# EAGLE design io_board (EAGLE 7.2.0)
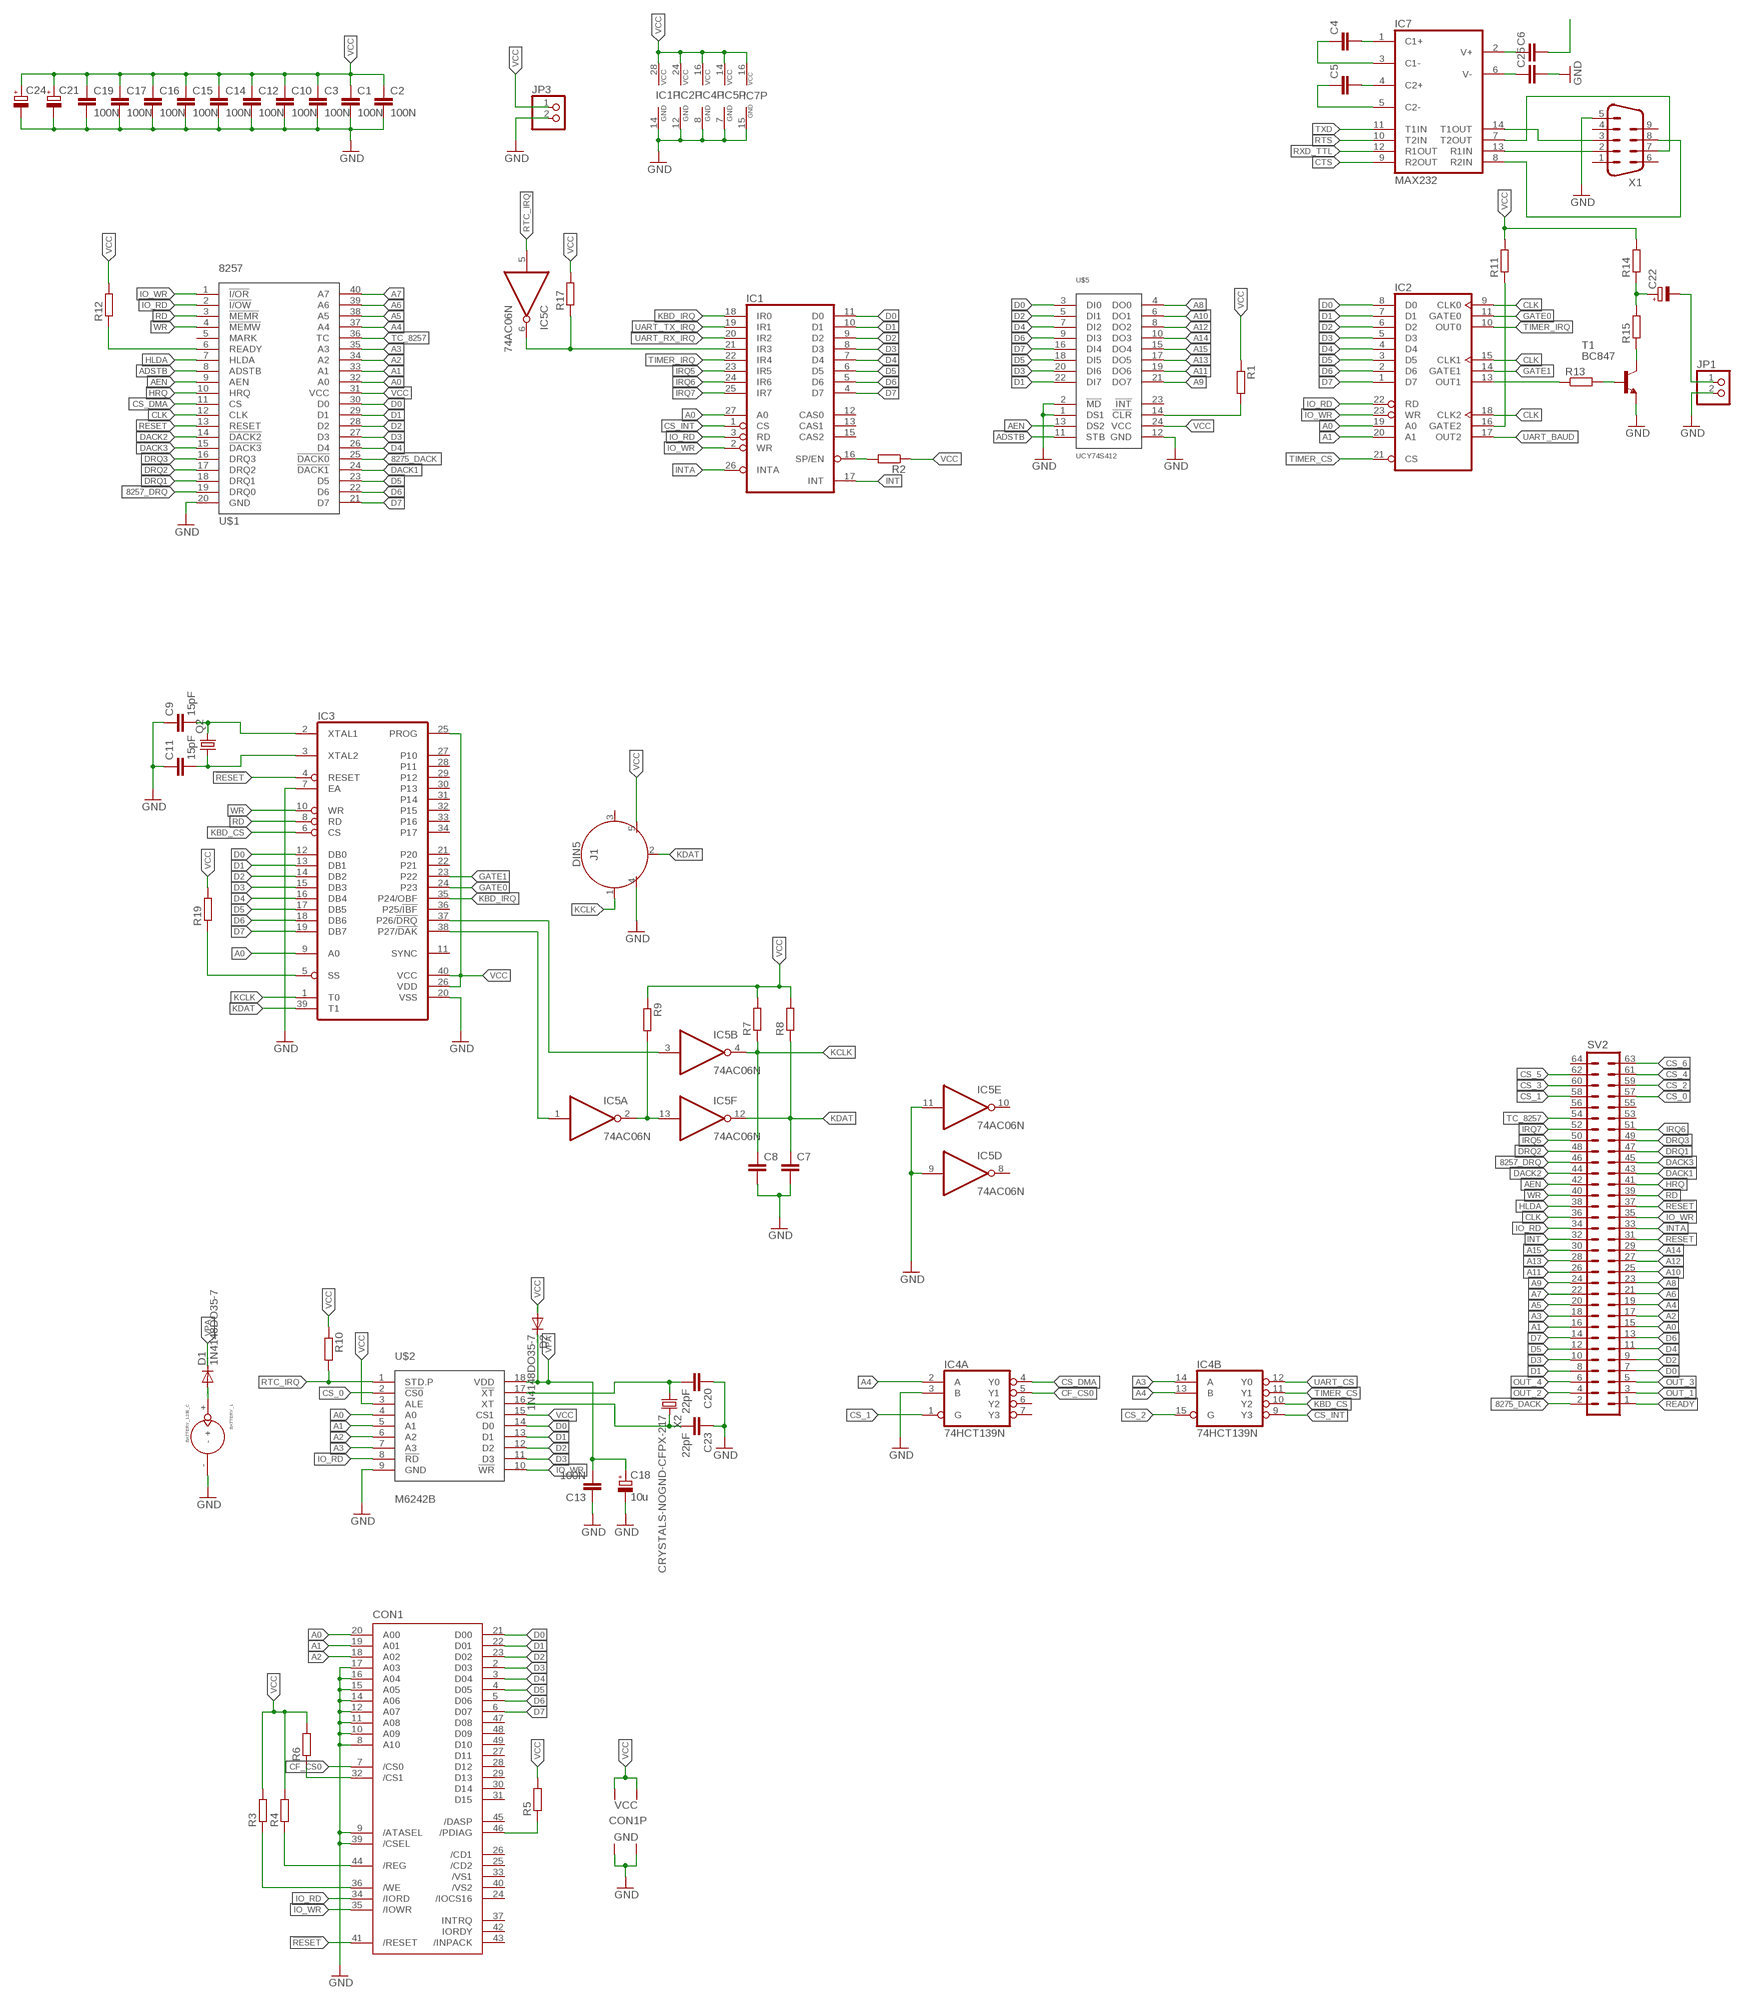
[diagram p0: schematic, sheet 1, part 1 of 2]
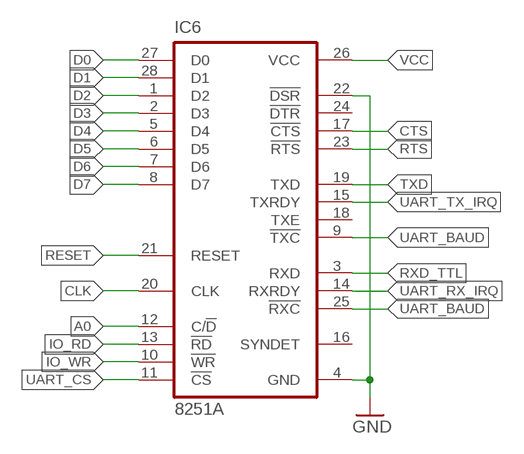
[diagram p1: schematic, sheet 1, part 2 of 2]

## Parts
BATTERY_1  BATTERY_1236_C  [BATTERY_1236_C]
C1  100N  C-EUC0603  [C0603]
C2  100N  C-EUC1206  [C1206]
C3  100N  C-EUC0603  [C0603]
C4  C-EUC0603  [C0603]
C5  C-EUC0603  [C0603]
C6  C-EUC0603  [C0603]
C7  C-EUC0603  [C0603]
C8  C-EUC0603  [C0603]
C9  15pF  C-EUC0603  [C0603]
C10  100N  C-EUC0603  [C0603]
C11  15pF  C-EUC0603  [C0603]
C12  100N  C-EUC0603  [C0603]
C13  100N  C-EUC0603  [C0603]
C14  100N  C-EUC0603  [C0603]
C15  100N  C-EUC0603  [C0603]
C16  100N  C-EUC0603  [C0603]
C17  100N  C-EUC0603  [C0603]
C18  10u  CPOL-EUSMCB  [SMC_B]
C19  100N  C-EUC0603  [C0603]
C20  22pF  C-EUC0603  [C0603]
C21  CPOL-EUE3.5-8  [E3,5-8]
C22  CPOL-EUE2-4  [E2-4]
C23  22pF  C-EUC0603  [C0603]
C24  CPOL-EUSMCB  [SMC_B]
C25  C-EUC0603  [C0603]
CON1  CF-CARD-IDE_MODE  [MI20-50PD-SF]
D1  1N4148DO35-7  [DO35-7]
D2  1N4148DO35-7  [DO35-7]
IC1  8259A  [DIL28-6]
IC2  8253  [DIL24-6]
IC3  UPI-8042AH  [DIL40]
IC4  74HCT139N  [DIL16]
IC5  74AC06N  [DIL14]
IC6  8251A  [DIL28-6]
IC7  MAX232  [DIL16]
J1  DIN5  [DIN5-RA-PTH]
JP1  PINHD-1X2  [1X02]
JP3  PINHD-1X2/90  [1X02/90]
Q2  CRYSTALHC49S  [HC49/S]
R1  R-EU_R0603  [R0603]
R2  R-EU_R0603  [R0603]
R3  R-EU_R0603  [R0603]
R4  R-EU_0204/7  [0204/7]
R5  R-EU_R0603  [R0603]
R6  R-EU_R0603  [R0603]
R7  R-EU_0204/5  [0204/5]
R8  R-EU_M0805  [M0805]
R9  R-EU_R0603  [R0603]
R10  R-EU_R0603  [R0603]
R11  R-EU_R0603  [R0603]
R12  R-EU_R0603  [R0603]
R13  R-EU_R0603  [R0603]
R14  R-EU_0204/5  [0204/5]
R15  R-EU_R0603  [R0603]
R17  R-EU_0204/7  [0204/7]
R19  R-EU_0204/5  [0204/5]
SV2  ML64L  [ML64L]
T1  BC847  [SOT23]
U$1  8257  [DIL40]
U$2  M6242B  [DIL18]
U$5  UCY74S412  [DIL24-6]
X1  M09HP  [M09HP]
X2  CRYSTALS-NOGND-CFPX-217  [3.2X1.5-2-PAD]

## Nets
8257_DRQ: SV2.46 U$1.19(DRQ0)
8275_DACK: SV2.2 U$1.25(!DACK0)
!RESET: CON1.41(/RESET) IC3.4(RESET) SV2.37
A0: CON1.20(A00) IC1.27(A0) IC2.19(A0) IC3.9(A0) IC6.12(C/!D) SV2.15 U$1.32(A0) U$2.4(A0)
A1: CON1.19(A01) IC2.20(A1) SV2.16 U$1.33(A1) U$2.5(A1)
A2: CON1.18(A02) SV2.17 U$1.34(A2) U$2.6(A2)
A3: IC4.14(B:A) SV2.18 U$1.35(A3) U$2.7(A3)
A4: IC4.2(A:A) IC4.13(B:B) SV2.19 U$1.37(A4)
A5: SV2.20 U$1.38(A5)
A6: SV2.21 U$1.39(A6)
A7: SV2.22 U$1.40(A7)
A8: SV2.23 U$5.4(DO0)
A9: SV2.24 U$5.21(DO7)
A10: SV2.25 U$5.6(DO1)
A11: SV2.26 U$5.19(DO6)
A12: SV2.27 U$5.8(DO2)
A13: SV2.28 U$5.17(DO5)
A14: SV2.29 U$5.10(DO3)
A15: SV2.30 U$5.15(DO4)
ADSTB: U$1.8(ADSTB) U$5.11(STB)
AEN: SV2.42 U$1.9(AEN) U$5.13(DS2)
CF_CS0: CON1.7(/CS0) IC4.5(A:Y1)
CLK: IC2.9(CLK0) IC2.15(CLK1) IC2.18(CLK2) IC6.20(CLK) SV2.36 U$1.12(CLK)
CS_0: SV2.57 U$2.2(!CS0)
CS_1: IC4.1(A:G) SV2.58
CS_2: IC4.15(B:G) SV2.59
CS_3: SV2.60
CS_4: SV2.61
CS_5: SV2.62
CS_6: SV2.63
CS_DMA: IC4.4(A:Y0) U$1.11(CS)
CS_INT: IC1.1(CS) IC4.9(B:Y3)
CTS: IC6.17(!CTS) IC7.9(R2OUT)
D0: CON1.21(D00) IC1.11(D0) IC2.8(D0) IC3.12(DB0) IC6.27(D0) SV2.7 U$1.30(D0) U$2.14(D0) U$5.3(DI0)
D1: CON1.22(D01) IC1.10(D1) IC2.7(D1) IC3.13(DB1) IC6.28(D1) SV2.8 U$1.29(D1) U$2.13(D1) U$5.22(DI7)
D2: CON1.23(D02) IC1.9(D2) IC2.6(D2) IC3.14(DB2) IC6.1(D2) SV2.9 U$1.28(D2) U$2.12(D2) U$5.5(DI1)
D3: CON1.2(D03) IC1.8(D3) IC2.5(D3) IC3.15(DB3) IC6.2(D3) SV2.10 U$1.27(D3) U$2.11(D3) U$5.20(DI6)
D4: CON1.3(D04) IC1.7(D4) IC2.4(D4) IC3.16(DB4) IC6.5(D4) SV2.11 U$1.26(D4) U$5.7(DI2)
D5: CON1.4(D05) IC1.6(D5) IC2.3(D5) IC3.17(DB5) IC6.6(D5) SV2.12 U$1.23(D5) U$5.18(DI5)
D6: CON1.5(D06) IC1.5(D6) IC2.2(D6) IC3.18(DB6) IC6.7(D6) SV2.13 U$1.22(D6) U$5.9(DI3)
D7: CON1.6(D07) IC1.4(D7) IC2.1(D7) IC3.19(DB7) IC6.8(D7) SV2.14 U$1.21(D7) U$5.16(DI4)
DACK1: SV2.43 U$1.24(!DACK1)
DACK2: SV2.44 U$1.14(!DACK2)
DACK3: SV2.45 U$1.15(!DACK3)
DRQ1: SV2.47 U$1.18(DRQ1)
DRQ2: SV2.48 U$1.17(DRQ2)
DRQ3: SV2.49 U$1.16(DRQ3)
GATE0: IC2.11(GATE0) IC3.24(P23)
GATE1: IC2.14(GATE1) IC3.23(P22)
GATE2: IC2.16(GATE2) R11.1
GND: BATTERY_1.- C1.2 C2.2 C3.2 C7.2 C8.2 C9.1 C10.2 C11.1 C12.2 C13.1 C14.2 C15.2 C16.2 C17.2 C18.- C19.2 C20.1 C21.- C23.1 C24.- C25.2 CON1.1(GND1) CON1.8(A10) CON1.9(/ATASEL) CON1.10(A09) CON1.11(A08) CON1.12(A07) CON1.14(A06) CON1.15(A05) CON1.16(A04) CON1.17(A03) CON1.39(/CSEL) CON1.50(GND2) IC1.14(GND) IC2.12(GND) IC3.7(EA) IC3.20(VSS) IC4.3(A:B) IC4.8(P:GND) IC5.7(P:GND) IC5.9(D:I) IC5.11(E:I) IC6.4(GND) IC6.22(!DSR) IC7.15(GND) J1.4 JP1.2 JP3.2 T1.2(E) U$1.20(GND) U$2.9(GND) U$5.1(DS1) U$5.2(!MD) U$5.12(GND) X1.5
HLDA: SV2.38 U$1.7(HLDA)
HRQ: SV2.41 U$1.10(HRQ)
INT: IC1.17(INT) SV2.32
INTA: IC1.26(INTA) SV2.33
IO_RD: CON1.34(/IORD) IC1.3(RD) IC2.22(RD) IC6.13(!RD) SV2.34 U$1.2(!I/OW) U$2.8(!RD)
IO_WR: CON1.35(/IOWR) IC1.2(WR) IC2.23(WR) IC6.10(!WR) SV2.35 U$1.1(!I/OR) U$2.10(!WR)
IRQ5: IC1.23(IR5) SV2.50
IRQ6: IC1.24(IR6) SV2.51
IRQ7: IC1.25(IR7) SV2.52
KBD_CS: IC3.6(CS) IC4.10(B:Y2)
KBD_IRQ: IC1.18(IR0) IC3.35(P24/OBF)
KCLK: C8.1 IC3.1(T0) IC5.4(B:O) J1.1 R7.1
KDAT: C7.1 IC3.39(T1) IC5.12(F:O) J1.2 R8.1
N$1: R1.2 U$5.14(!CLR)
N$2: IC1.16(SP/EN) R2.2
N$3: IC3.38(P27/!DAK) IC5.1(A:I)
N$4: CON1.36(/WE) R3.1
N$5: R12.1 U$1.6(READY)
N$6: IC2.13(OUT1) R13.1
N$7: IC7.7(T2OUT) X1.7
N$8: IC7.13(R1IN) X1.2
N$9: C4.2 IC7.1(C1+)
N$10: C5.2 IC7.4(C2+)
N$11: C5.1 IC7.5(C2-)
N$12: C4.1 IC7.3(C1-)
N$13: C6.1 IC7.2(V+)
N$14: C25.1 IC7.6(V-)
N$15: C9.2 IC3.2(XTAL1) Q2.2
N$16: C11.2 IC3.3(XTAL2) Q2.1
N$17: IC3.37(P26/!DRQ) IC5.3(B:I)
N$18: IC7.14(T1OUT) X1.3
N$19: CON1.44(/REG) R4.1
N$20: IC5.2(A:O) IC5.13(F:I) R9.2
N$21: CON1.46(/PDIAG) R5.1
N$22: BATTERY_1.+ D1.A
N$26: R13.2 T1.1(B)
N$27: R15.1 T1.3(C)
N$28: IC7.8(R2IN) X1.8
N$29: CON1.32(/CS1) R6.1
N$30: C22.- JP1.1
N$31: C22.+ R14.1 R15.2
N$32: IC1.21(IR3) IC5.6(C:O) R17.1
N$35: IC3.5(SS) R19.1
OUT_1: SV2.3
OUT_2: SV2.4
OUT_3: SV2.5
OUT_4: SV2.6
RD: IC3.8(RD) SV2.39 U$1.3(!MEMR)
READY: SV2.1
RESET: IC6.21(RESET) SV2.31 U$1.13(RESET)
RTC_IRQ: IC5.5(C:I) R10.2 U$2.1(STD.P)
RTS: IC6.23(!RTS) IC7.10(T2IN)
RXD_TTL: IC6.3(RXD) IC7.12(R1OUT)
SOSCI: C20.2 U$2.17(!XT) X2.1
SOSCO: C23.2 U$2.16(XT) X2.2
TC_8257: SV2.54 U$1.36(TC)
TIMER_CS: IC2.21(CS) IC4.11(B:Y1)
TIMER_IRQ: IC1.22(IR4) IC2.10(OUT0)
TXD: IC6.19(TXD) IC7.11(T1IN)
UART_BAUD: IC2.17(OUT2) IC6.9(!TXC) IC6.25(!RXC)
UART_CS: IC4.12(B:Y0) IC6.11(!CS)
UART_RX_IRQ: IC1.20(IR2) IC6.14(RXRDY)
UART_TX_IRQ: IC1.19(IR1) IC6.15(TXRDY)
VCC: C1.1 C2.1 C3.1 C6.2 C10.1 C12.1 C14.1 C15.1 C16.1 C17.1 C19.1 C21.+ C24.+ CON1.13(VCC2) CON1.38(VCC1) D2.A IC1.28(VCC) IC2.24(VCC) IC3.25(PROG) IC3.26(VDD) IC3.40(VCC) IC4.16(P:VCC) IC5.14(P:VCC) IC6.26(VCC) IC7.16(VCC) J1.5 JP3.1 R1.1 R2.1 R3.2 R4.2 R5.2 R6.2 R7.2 R8.2 R9.1 R10.1 R11.2 R12.2 R14.2 R17.2 R19.2 U$1.31(VCC) U$2.3(ALE) U$2.15(CS1) U$5.24(VCC)
VPA: C13.2 C18.+ D1.C D2.C U$2.18(VDD)
WR: IC3.10(WR) SV2.40 U$1.4(!MEMW)
Unconnected: CON1.24(/IOCS16) CON1.25(/CD2) CON1.26(/CD1) CON1.27(D11) CON1.28(D12) CON1.29(D13) CON1.30(D14) CON1.31(D15) CON1.33(/VS1) CON1.37(INTRQ) CON1.40(/VS2) CON1.42(IORDY) CON1.43(/INPACK) CON1.45(/DASP) CON1.47(D08) CON1.48(D09) CON1.49(D10) IC1.12(CAS0) IC1.13(CAS1) IC1.15(CAS2) IC3.11(SYNC) IC3.21(P20) IC3.22(P21) IC3.27(P10) IC3.28(P11) IC3.29(P12) IC3.30(P13) IC3.31(P14) IC3.32(P15) IC3.33(P16) IC3.34(P17) IC3.36(P25/!IBF) IC4.6(A:Y2) IC4.7(A:Y3) IC5.8(D:O) IC5.10(E:O) IC6.16(SYNDET) IC6.18(TXE) IC6.24(!DTR) J1.3 SV2.53 SV2.55 SV2.56 SV2.64 U$1.5(MARK) U$5.23(!INT) X1.1 X1.4 X1.6 X1.9

## Library data of the parts
BATTERY_1 = Itead_BP_110825.lbr:BATTERY_1236_C: SOC004
C1-C17 C19 C20 C23 C25 = rcl:C-EU: CAPACITOR, European symbol
C18 C21 C22 C24 = rcl:CPOL-EU: POLARIZED CAPACITOR, European symbol
CON1 = con-hirose:CF-CARD-IDE_MODE: Compact Flash Adapter Type I or II without Eject Button Source: con-hirose.lbr from Bob Starr <rtzaudio@mindspring.com>; OC_FARNELL: unknown; OC_NEWARK: unknown
D1 D2 = diode:1N4148: DIODE high speed (Philips)
IC1 = micro-intel:8259A: MICROCOMPUTER/PERIPHERAL DEVICE; OC_FARNELL: unknown; OC_NEWARK: unknown
IC2 = micro-intel:8253: MICROCOMPUTER/PERIPHERAL DEVICE; OC_FARNELL: unknown; OC_NEWARK: unknown
IC3 = micro-intel:UPI-8042AH: MICROCOMPUTER/PERIPHERAL DEVICE; OC_FARNELL: unknown; OC_NEWARK: unknown
IC4 = 74xx-eu:74*139: Dual 2-line to 4-line DECODER/DEMULTIPLEXER
IC5 = 74xx-eu:74*06: Hex INVERTER, open collector high-voltage output
IC6 = micro-intel:8251A: Universal Syncronous/Asynchronous Receiver/Transmitter (USART) Source: http://www.alldatasheet.com/datasheet-pdf/pdf/INTEL/8251A.html; OC_FARNELL: unknown; OC_NEWARK: unknown
IC7 = maxim:MAX232: RS232 TRANSCEIVER; MF: MAXIM; MPN: MAX232ACPE+; OC_FARNELL: 9723773; OC_NEWARK: 68K4544
J1 = SparkFun-Connectors:DIN5: DIN5 Connector - Female Right Angle (frequently used as a MIDI Jack connector) This type of connector and cable is frequently used for transmitting midi data (musical instrument digital interface). It is what you usually see on a keyboard or set of electronic drums. Learn more here <https://en.wikipedia.org/wiki/MIDI>. For more information on the pinout and electrical specifications of MIDI communications, please see the following resource: https://www.midi.org/specifications/item/midi-din-electrical-specification Here is the connector we sell at SparkFun: MIDI Connector - Female Right Angle <https://www.sparkfun.com/products/9536> (PRT-09536) Datasheet <hhttp://www.sparkfun.com/datasheets/Prototyping/Connectors/MIDI-RA.pdf> It is used on this SparkFun product: SparkFun MIDI Shield <https://www.sparkfun.com/products/12898> (DEV-12898); PROD_ID: CONN-09481
JP1 JP3 = pinhead:PINHD-1X2: PIN HEADER
Q2 = crystal:CRYSTAL: CRYSTAL; OC_FARNELL: 1667008; OC_NEWARK: unknown
R1-R15 R17 R19 = rcl:R-EU_: RESISTOR, European symbol
SV2 = con-harting-ml:ML64: HARTING; OC_FARNELL: unknown; OC_NEWARK: unknown
T1 = transistor:BC847: NPN TRANSISTOR
U$1 = mw:8257
U$2 = mw:M6242B
U$5 = mw:UCY74S412
X1 = con-subd:M09: SUB-D; OC_FARNELL: unknown; OC_NEWARK: unknown
X2 = IQD-Frequency-Products:CRYSTALS-NOGND: CRYSTALS CAN NOT GROUNDED

## Board
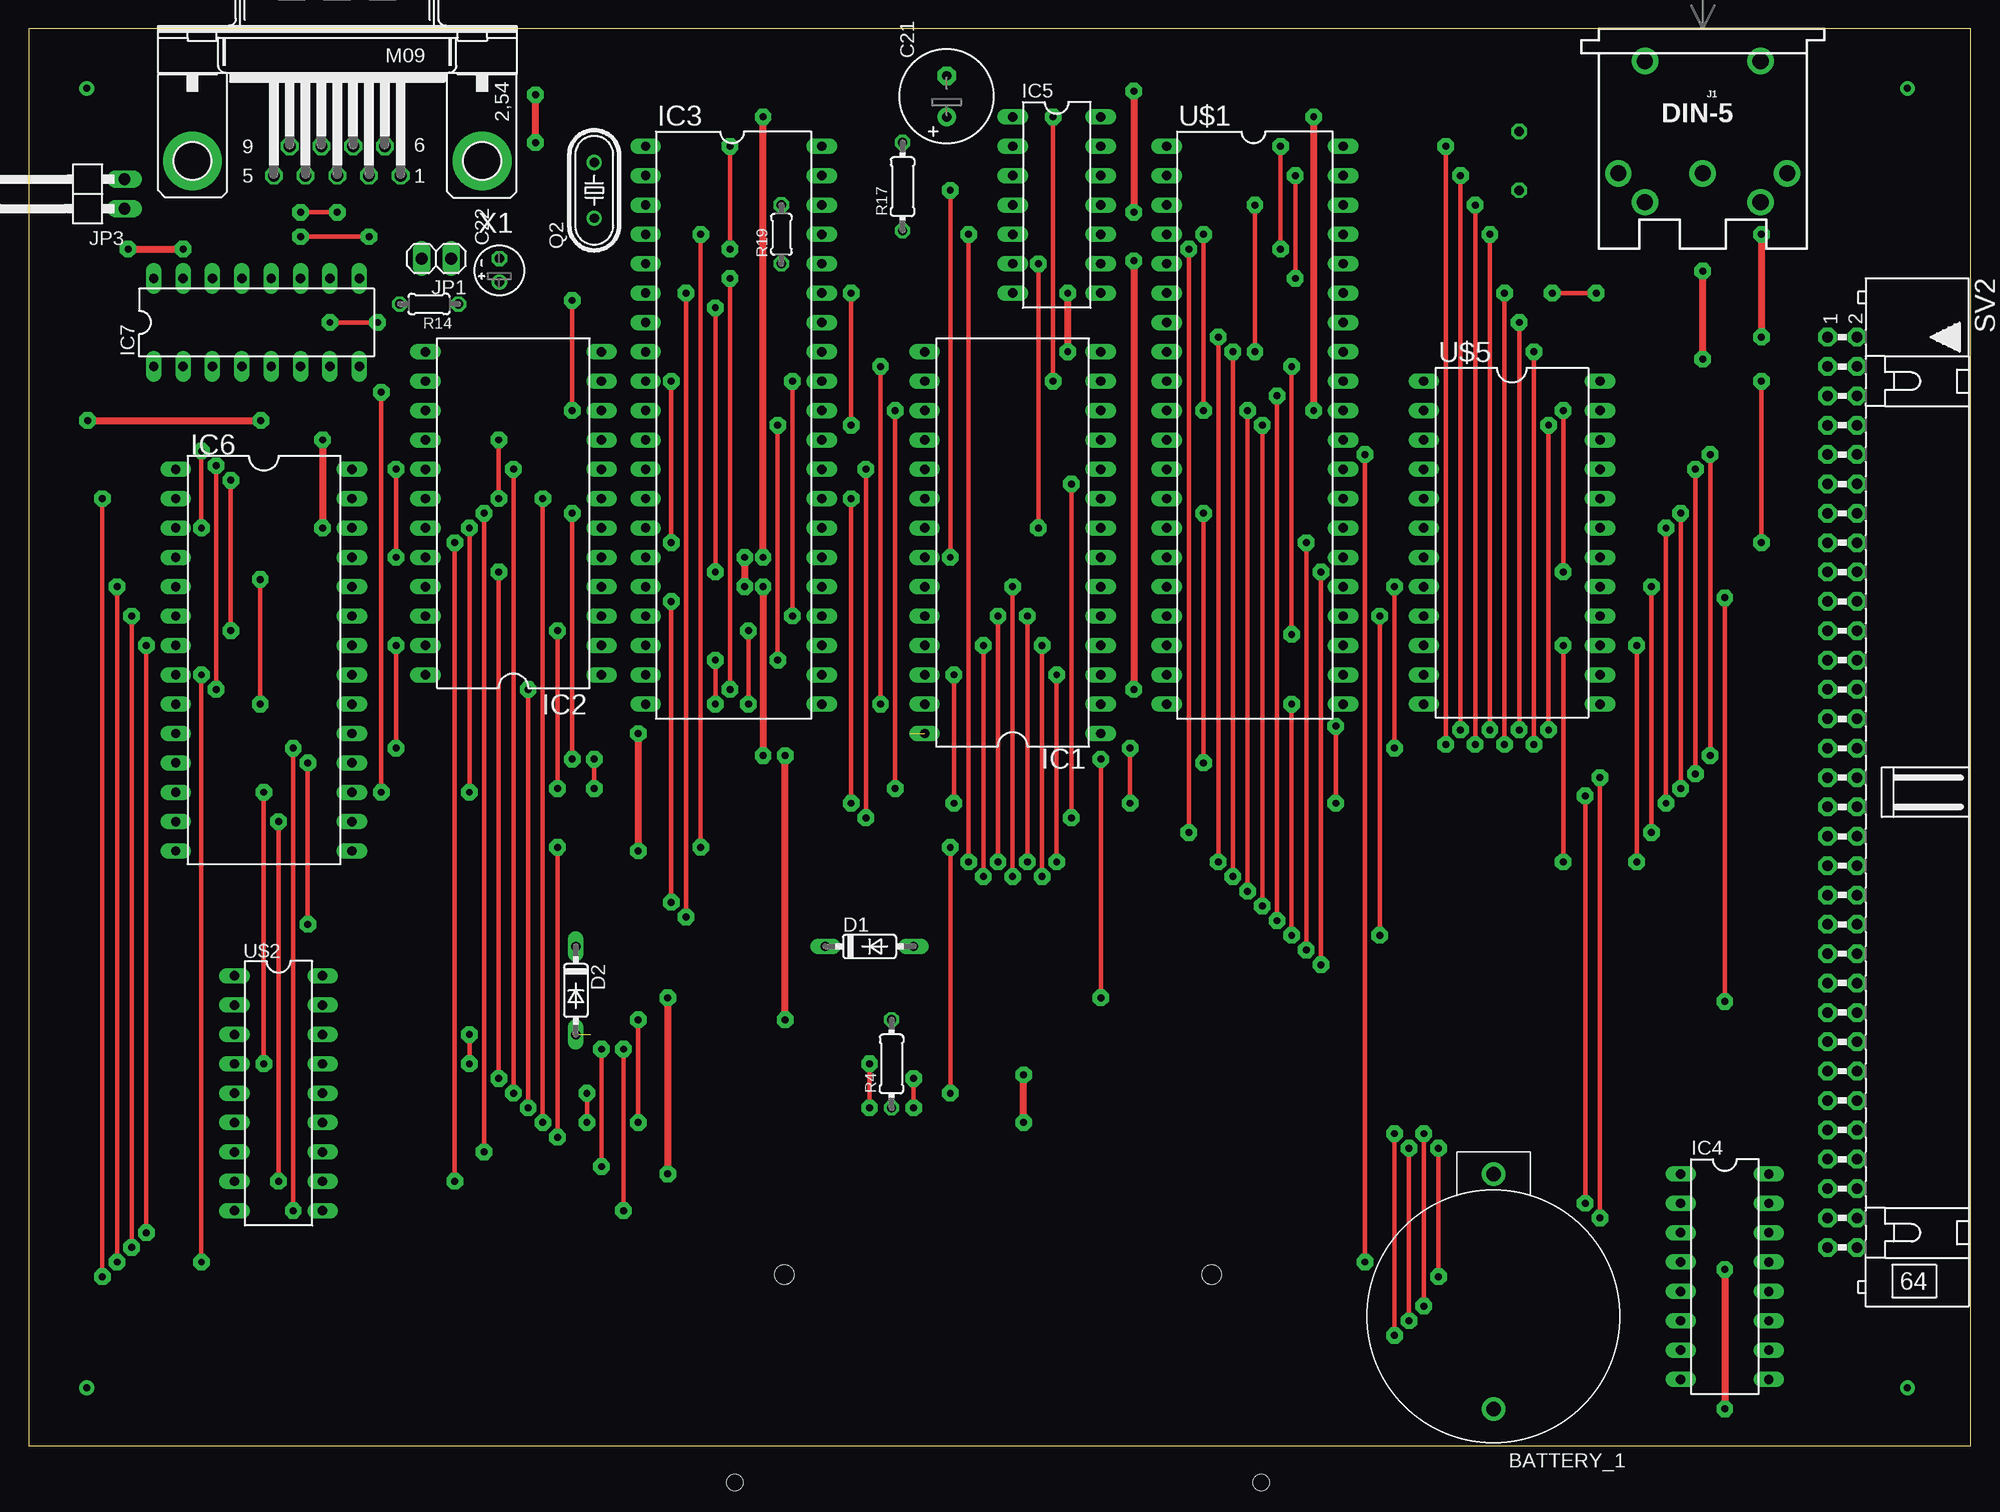
[diagram p2: board, top side]
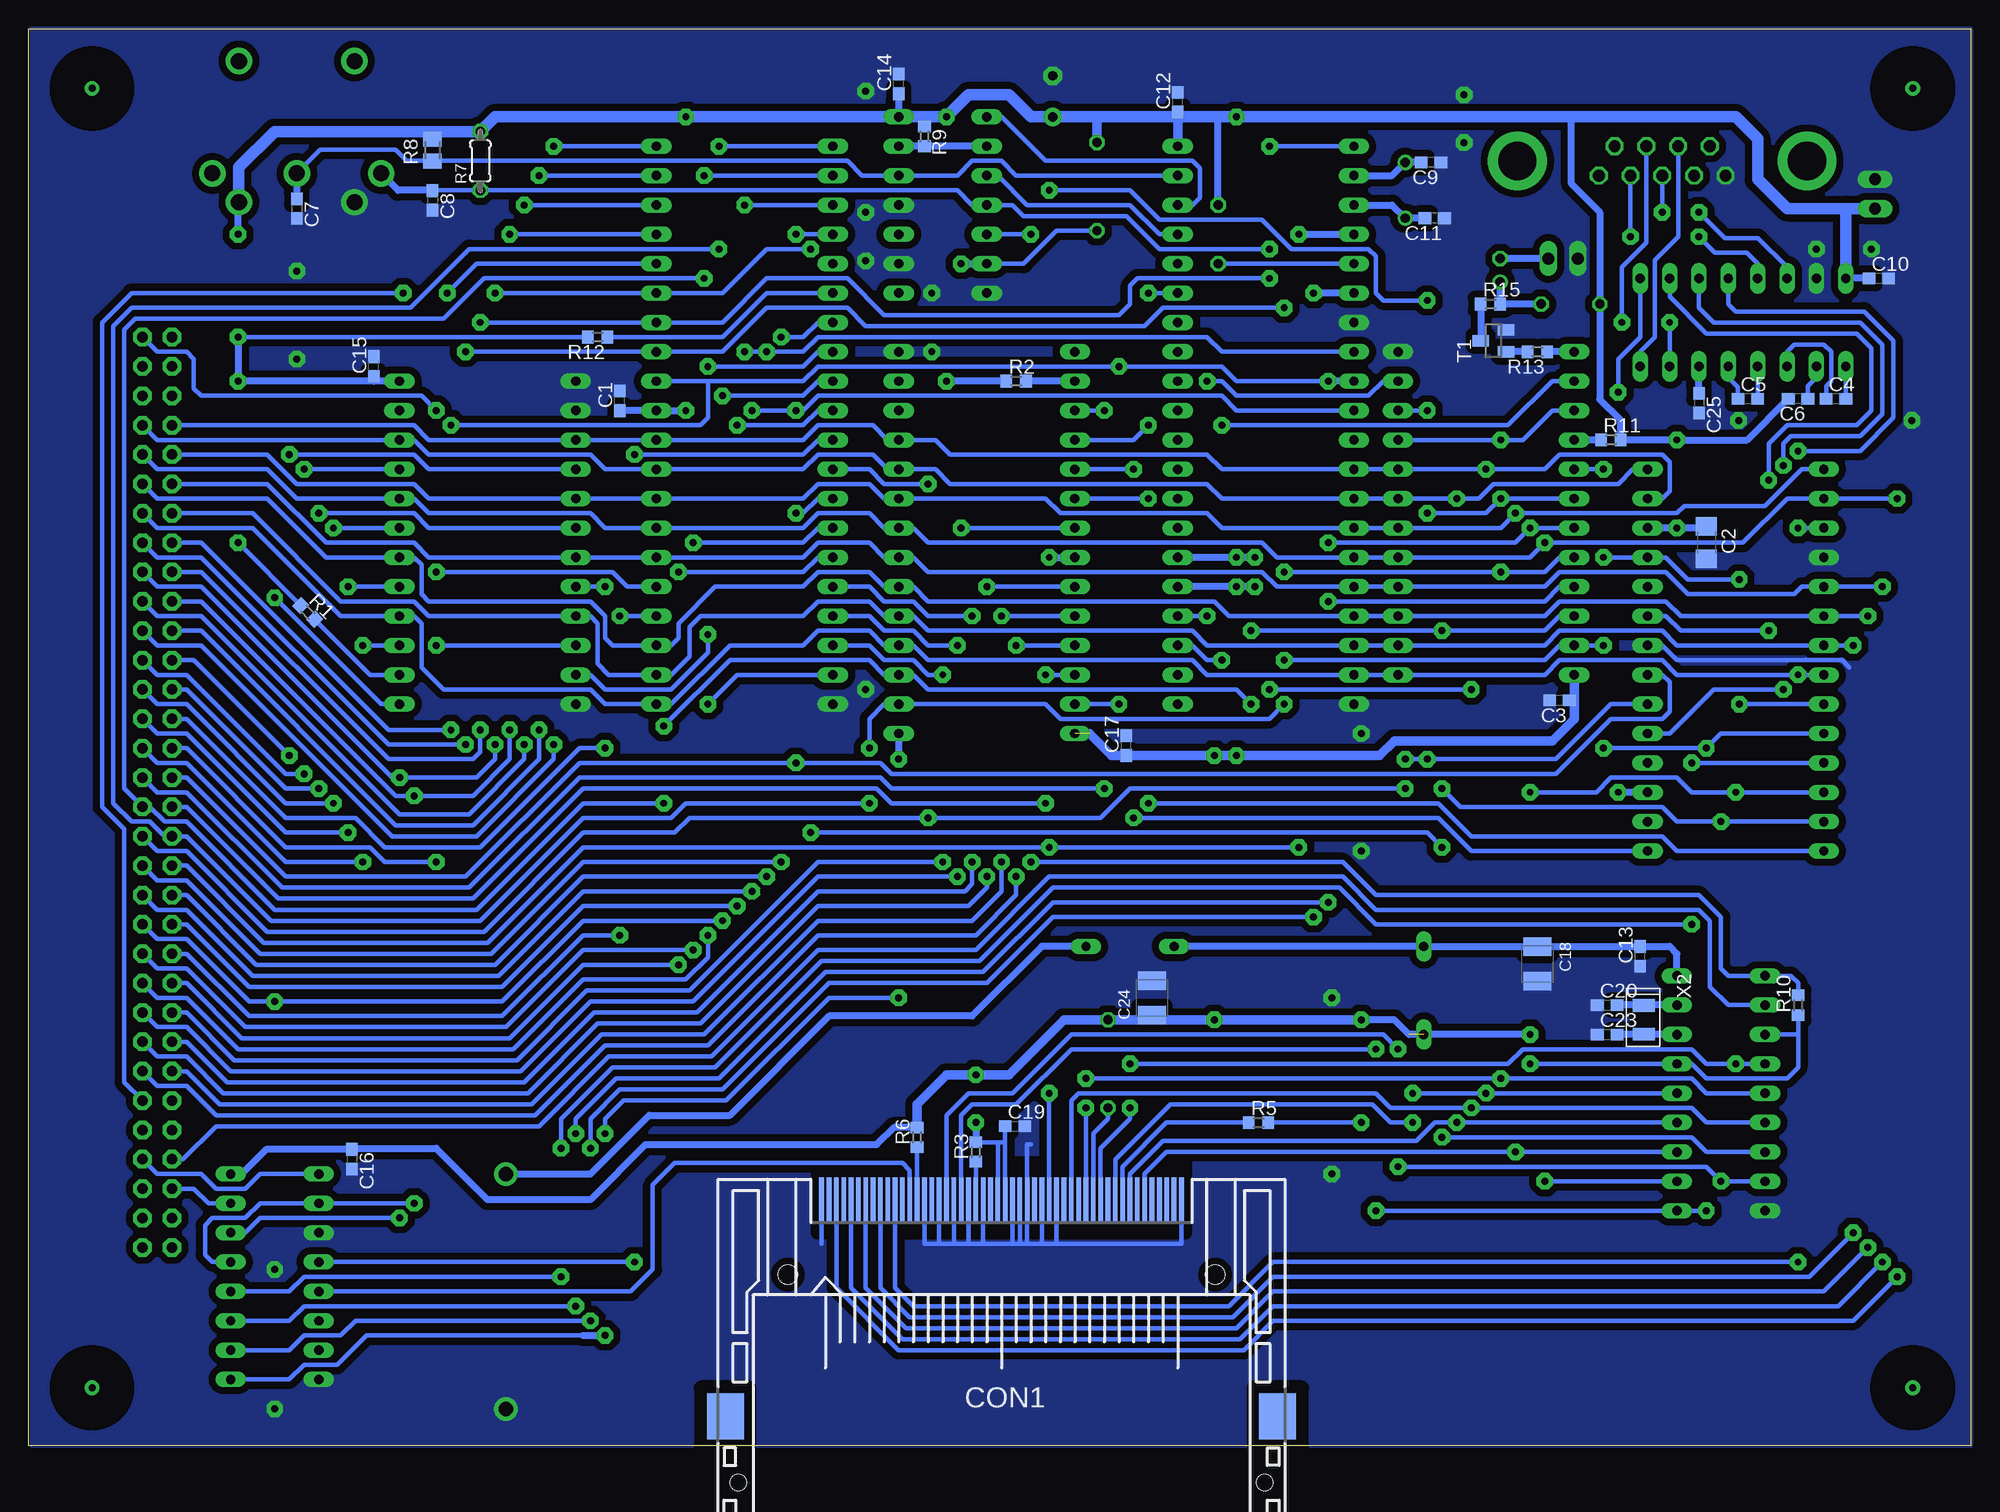
[diagram p3: board, bottom side, seen from below]

Size 167.94 x 122.55 mm. Coordinates in mm from the lower left corner, seen from the top.
Outline: 0,0 167.94,0 167.94,122.55 0,122.55 0,0
Copper layers (1*16): Top 0.035mm / dielectric 1.5mm / Bottom 0.035mm
Design rules "default *": minimum track width 10mil, minimum drill 24mil, track to track 8mil, track to pad 8mil, pad to pad 8mil, via to via 8mil, smd to smd 8mil, copper to edge 0mil, drill to drill 8mil, minimum pad ring 10mil, minimum via ring 8mil, stop-mask expansion 4mil, vias tented up to drill 0mil, thermal gap 10mil
bRestrict: area 2,2 to 8,8; area 2,114.3 to 8,120.4; area 159.4,2 to 165.5,8; area 159.4,114.3 to 165.5,120.4; area 67.9,18.4 to 99.7,24.4

### Footprints (pad centres in the part's own frame; a part is rotated, then mirrored left to right if it is on the bottom)
BATTERY_1236_C = drill 1.27 pad 2.032: + 0,0; - 0,20.32
C0603 = smd 1.1 x 1: 1 -0.85,0; 2 0.85,0
C1206 = smd 1.6 x 1.8: 1 -1.4,0; 2 1.4,0
SMC_B = smd 1.6 x 2.4: + -1.5,0; - 1.5,0
E3,5-8 = drill 0.813 pad 1.6: + -1.778,0 | drill 0.813 pad 1.6 octagon: - 1.778,0
E2-4 = drill 0.813 pad 1.27: + -1.016,0 | drill 0.813 pad 1.27 octagon: - 1.016,0
MI20-50PD-SF = smd 0.41 x 3.75: 1 15.557,-18.78; 2 14.287,-18.78; 3 13.018,-18.78; 4 11.748,-18.78; 5 10.477,-18.78; 6 9.207,-18.78; 7 7.938,-18.78; 8 6.668,-18.78; 9 5.397,-18.78; 10 4.128,-18.78; 11 2.857,-18.78; 12 1.587,-18.78; 13 0.318,-18.78; 14 -0.953,-18.78; 15 -2.223,-18.78; 16 -3.493,-18.78; 17 -4.763,-18.78; 18 -6.032,-18.78; 19 -7.303,-18.78; 20 -8.572,-18.78; 21 -9.842,-18.78; 22 -11.113,-18.78; 23 -12.383,-18.78; 24 -13.652,-18.78; 25 -14.922,-18.78; 26 14.922,-18.78; 27 13.652,-18.78; 28 12.383,-18.78; 29 11.113,-18.78; 30 9.842,-18.78; 31 8.572,-18.78; 32 7.303,-18.78; 33 6.032,-18.78; 34 4.763,-18.78; 35 3.493,-18.78; 36 2.223,-18.78; 37 0.953,-18.78; 38 -0.318,-18.78; 39 -1.587,-18.78; 40 -2.857,-18.78; 41 -4.128,-18.78; 42 -5.397,-18.78; 43 -6.668,-18.78; 44 -7.938,-18.78; 45 -9.207,-18.78; 46 -10.477,-18.78; 47 -11.748,-18.78; 48 -13.018,-18.78; 49 -14.287,-18.78; 50 -15.557,-18.78 | smd 3.2 x 4: M1 -23.883,-0.005; M2 23.883,-0.005 | hole 1.676: 18.5,-12.25; -18.5,-12.25 | hole 1.422: -22.75,5.75; 22.75,5.75
DO35-7 = drill 0.813 long: A 3.81,0; C -3.81,0
DIL28-6 = drill 0.813 long: 1 -16.51,-7.62; 2 -13.97,-7.62; 3 -11.43,-7.62; 4 -8.89,-7.62; 5 -6.35,-7.62; 6 -3.81,-7.62; 7 -1.27,-7.62; 8 1.27,-7.62; 9 3.81,-7.62; 10 6.35,-7.62; 11 8.89,-7.62; 12 11.43,-7.62; 13 13.97,-7.62; 14 16.51,-7.62; 15 16.51,7.62; 16 13.97,7.62; 17 11.43,7.62; 18 8.89,7.62; 19 6.35,7.62; 20 3.81,7.62; 21 1.27,7.62; 22 -1.27,7.62; 23 -3.81,7.62; 24 -6.35,7.62; 25 -8.89,7.62; 26 -11.43,7.62; 27 -13.97,7.62; 28 -16.51,7.62
DIL24-6 = drill 0.813 long: 1 -13.97,-7.62; 2 -11.43,-7.62; 3 -8.89,-7.62; 4 -6.35,-7.62; 5 -3.81,-7.62; 6 -1.27,-7.62; 7 1.27,-7.62; 8 3.81,-7.62; 9 6.35,-7.62; 10 8.89,-7.62; 11 11.43,-7.62; 12 13.97,-7.62; 13 13.97,7.62; 14 11.43,7.62; 15 8.89,7.62; 16 6.35,7.62; 17 3.81,7.62; 18 1.27,7.62; 19 -1.27,7.62; 20 -3.81,7.62; 21 -6.35,7.62; 22 -8.89,7.62; 23 -11.43,7.62; 24 -13.97,7.62
DIL40 = drill 0.813 long: 1 -24.13,-7.62; 2 -21.59,-7.62; 3 -19.05,-7.62; 4 -16.51,-7.62; 5 -13.97,-7.62; 6 -11.43,-7.62; 7 -8.89,-7.62; 8 -6.35,-7.62; 9 -3.81,-7.62; 10 -1.27,-7.62; 11 1.27,-7.62; 12 3.81,-7.62; 13 6.35,-7.62; 14 8.89,-7.62; 15 11.43,-7.62; 16 13.97,-7.62; 17 16.51,-7.62; 18 19.05,-7.62; 19 21.59,-7.62; 20 24.13,-7.62; 21 24.13,7.62; 22 21.59,7.62; 23 19.05,7.62; 24 16.51,7.62; 25 13.97,7.62; 26 11.43,7.62; 27 8.89,7.62; 28 6.35,7.62; 29 3.81,7.62; 30 1.27,7.62; 31 -1.27,7.62; 32 -3.81,7.62; 33 -6.35,7.62; 34 -8.89,7.62; 35 -11.43,7.62; 36 -13.97,7.62; 37 -16.51,7.62; 38 -19.05,7.62; 39 -21.59,7.62; 40 -24.13,7.62
DIL16 = drill 0.813 long: 1 -8.89,-3.81; 2 -6.35,-3.81; 3 -3.81,-3.81; 4 -1.27,-3.81; 5 1.27,-3.81; 6 3.81,-3.81; 7 6.35,-3.81; 8 8.89,-3.81; 9 8.89,3.81; 10 6.35,3.81; 11 3.81,3.81; 12 1.27,3.81; 13 -1.27,3.81; 14 -3.81,3.81; 15 -6.35,3.81; 16 -8.89,3.81
DIL14 = drill 0.813 long: 1 -7.62,-3.81; 2 -5.08,-3.81; 3 -2.54,-3.81; 4 0,-3.81; 5 2.54,-3.81; 6 5.08,-3.81; 7 7.62,-3.81; 8 7.62,3.81; 9 5.08,3.81; 10 2.54,3.81; 11 0,3.81; 12 -2.54,3.81; 13 -5.08,3.81; 14 -7.62,3.81
DIN5-RA-PTH = drill 1.4 pad 2.286: 1 7.3,12.5; 2 0,12.5; 3 -7.3,12.5; 4 5,15; 5 -5,15; 6 -5,2.8; 7 5,2.8
1X02 = drill 1.016 long: 1 -1.27,0; 2 1.27,0
1X02/90 = drill 1.016 long: 1 -1.27,-3.81; 2 1.27,-3.81
HC49/S = drill 0.813: 1 -2.413,0; 2 2.413,0
R0603 = smd 1 x 1.1: 1 -0.85,0; 2 0.85,0
0204/7 = drill 0.813 octagon: 1 -3.81,0; 2 3.81,0
0204/5 = drill 0.813 octagon: 1 -2.54,0; 2 2.54,0
M0805 = smd 1.3 x 1.6: 1 -0.95,0; 2 0.95,0
ML64L = drill 0.914 pad 1.6 octagon: 1 -39.37,-1.27; 2 -39.37,1.27; 3 -36.83,-1.27; 4 -36.83,1.27; 5 -34.29,-1.27; 6 -34.29,1.27; 7 -31.75,-1.27; 8 -31.75,1.27; 9 -29.21,-1.27; 10 -29.21,1.27; 11 -26.67,-1.27; 12 -26.67,1.27; 13 -24.13,-1.27; 14 -24.13,1.27; 15 -21.59,-1.27; 16 -21.59,1.27; 17 -19.05,-1.27; 18 -19.05,1.27; 19 -16.51,-1.27; 20 -16.51,1.27; 21 -13.97,-1.27; 22 -13.97,1.27; 23 -11.43,-1.27; 24 -11.43,1.27; 25 -8.89,-1.27; 26 -8.89,1.27; 27 -6.35,-1.27; 28 -6.35,1.27; 29 -3.81,-1.27; 30 -3.81,1.27; 31 -1.27,-1.27; 32 -1.27,1.27; 33 1.27,-1.27; 34 1.27,1.27; 35 3.81,-1.27; 36 3.81,1.27; 37 6.35,-1.27; 38 6.35,1.27; 39 8.89,-1.27; 40 8.89,1.27; 41 11.43,-1.27; 42 11.43,1.27; 43 13.97,-1.27; 44 13.97,1.27; 45 16.51,-1.27; 46 16.51,1.27; 47 19.05,-1.27; 48 19.05,1.27; 49 21.59,-1.27; 50 21.59,1.27; 51 24.13,-1.27; 52 24.13,1.27; 53 26.67,-1.27; 54 26.67,1.27; 55 29.21,-1.27; 56 29.21,1.27; 57 31.75,-1.27; 58 31.75,1.27; 59 34.29,-1.27; 60 34.29,1.27; 61 36.83,-1.27; 62 36.83,1.27; 63 39.37,-1.27; 64 39.37,1.27
SOT23 = smd 1 x 1.4: 1 -0.95,-1.1; 2 0.95,-1.1; 3 0,1.1
DIL18 = drill 0.813 long: 1 -10.16,-3.81; 2 -7.62,-3.81; 3 -5.08,-3.81; 4 -2.54,-3.81; 5 0,-3.81; 6 2.54,-3.81; 7 5.08,-3.81; 8 7.62,-3.81; 9 10.16,-3.81; 10 10.16,3.81; 11 7.62,3.81; 12 5.08,3.81; 13 2.54,3.81; 14 0,3.81; 15 -2.54,3.81; 16 -5.08,3.81; 17 -7.62,3.81; 18 -10.16,3.81
M09HP = drill 1.016 octagon: 1 -5.486,1.27; 2 -2.743,1.27; 3 0,1.27; 4 2.743,1.27; 5 5.486,1.27; 6 -4.115,-1.27; 7 -1.372,-1.27; 8 1.372,-1.27; 9 4.115,-1.27 | drill 3.302 pad 5.08: G1 -12.522,0; G2 12.522,0
3.2X1.5-2-PAD = smd 1.1 x 1.9: 1 -1.25,0; 2 1.25,0

### Placement (x,y rotation side)
BATTERY_1  126.68,23.5 180 top
C1  116.84,90.39 90 bottom
C2  22.86,78.11 270 bottom
C3  35.56,64.45 180 bottom
C4  11.65,90.55 0 bottom
C5  19.27,90.55 0 bottom
C6  14.92,90.55 180 bottom
C7  144.78,107 270 bottom
C8  133.03,107.71 270 bottom
C9  46.67,111 180 bottom
C10  7.94,100.97 0 bottom
C11  46.35,106.17 180 bottom
C12  68.58,116.2 90 bottom
C13  28.57,42.33 90 bottom
C14  92.71,117.79 90 bottom
C15  138.11,93.34 90 bottom
C16  140.02,24.77 270 bottom
C17  73.03,60.54 90 bottom
C18  37.47,41.67 270 bottom
C19  82.65,27.62 0 bottom
C20  31.43,38.1 0 bottom
C21  79.38,116.71 90 top
C22  40.69,101.66 90 top
C23  31.43,35.56 0 bottom
C24  70.8,38.73 90 bottom
C25  23.5,90.17 270 bottom
CON1  83.82,2.54 180 bottom
D1  72.71,43.18 0 top
D2  47.31,39.37 270 top
IC1  85.09,78.11 90 top
IC2  41.91,80.64 90 top
IC3  60.96,88.27 270 top
IC4  146.69,14.61 270 top
IC5  88.9,107.31 270 top
IC6  20.32,67.94 270 top
IC7  19.68,97.16 0 top
J1  144.78,122.56 180 top
JP1  35.24,102.68 180 top
JP3  4.45,108.27 90 top
Q2  48.9,108.58 90 top
R1  143.83,72.07 315 bottom
R2  82.55,92.08 0 bottom
R3  86.04,25.4 90 bottom
R4  74.61,33.02 90 top
R5  61.59,27.94 0 bottom
R6  91.12,26.67 90 bottom
R7  128.91,111.12 90 bottom
R8  133.03,112.07 90 bottom
R9  90.49,113.25 270 bottom
R10  14.92,38.1 90 bottom
R11  31.11,87 0 bottom
R12  118.75,95.89 180 bottom
R13  37.47,94.61 180 bottom
R14  34.61,98.74 180 top
R15  41.54,98.74 0 bottom
R17  75.56,108.9 90 top
R19  65.09,104.78 90 top
SV2  156.84,56.52 270 top
T1  41.27,95.57 90 bottom
U$1  106.05,88.27 270 top
U$2  21.59,30.48 270 top
U$5  128.27,78.11 270 top
X1  26.67,111.12 180 top
X2  28.26,36.83 270 bottom

### Tracks (layer width: path | path; a pad name or v marks a point on that pad's centre or on a via)
8257_DRQ  (via drill 0.6 pad 1.42)
  Top 0.406: v109.22,64.14 v109.22,44.13
  Bottom 0.406: U$1.19 106.68,66.67 v109.22,64.14 | SV2.46 156.84,38.73 154.31,38.73 149.86,34.29 126.05,34.29 120.02,40.32 111.12,40.32 109.22,42.23 v109.22,44.13
8275_DACK  (via drill 0.6 pad 1.42)
  Top 0.406: v132.72,75.56 v132.72,89.53
  Bottom 0.406: U$1.25 116.2,74.3 117.47,75.56 v132.72,75.56 | SV2.2 156.84,94.61 154.31,94.61 153.67,93.98 153.67,91.44 153.03,90.81 133.99,90.81 v132.72,89.53
!RESET  (via drill 0.6 pad 1.42)
  Top 0.406: v58.1,51.75 v58.1,104.78 | v79.69,30.48 v79.69,51.75
  Bottom 0.406: SV2.37 154.31,50.16 147.64,43.5 128.27,43.5 120.02,51.75 v58.1,51.75 v79.69,51.75 | CON1.41 v79.69,30.48
  Bottom 0.61: v58.1,104.78 IC3.4
A0  (via drill 0.6 pad 1.42)
  Top 0.406: v131.44,61.91 v131.44,88.27 | v73.66,64.14 v73.66,93.34 | v55.56,78.11 v55.56,92.08 | v38.1,56.52 v38.1,79.38 | v20.32,33.02 v20.32,56.52 | v72.71,33.02 v72.71,29.21
  Bottom 0.406: SV2.15 153.03,78.11 136.84,61.91 v131.44,61.91 | v131.44,88.27 109.86,88.27 109.22,88.9 109.22,92.08 | 109.22,92.08 100.97,92.08 99.69,93.34 v73.66,93.34 64.77,93.34 63.5,92.08 v55.56,92.08 | 109.22,92.08 U$1.32 | IC1.27 v73.66,64.14 | U$2.4 v20.32,33.02 22.86,33.02 24.13,34.29 38.73,34.29 40.01,33.02 v72.71,33.02 | IC6.12 v20.32,56.52 24.13,56.52 25.4,57.78 31.11,57.78 32.38,56.52 v38.1,56.52 | IC2.19 v38.1,79.38 39.37,78.11 v55.56,78.11 | CON1.20 75.25,25.72 72.71,28.26 v72.71,29.21
  Bottom 0.61: IC3.9 v55.56,92.08
A1  (via drill 0.6 pad 1.42)
  Top 0.406: v130.18,60.64 v130.18,94.61 | v59.37,75.56 v59.37,98.42 | v40.64,31.75 v40.64,75.56 | v76.52,29.21 v76.52,31.75
  Bottom 0.406: SV2.16 156.84,76.83 153.03,76.83 136.84,60.64 v130.18,60.64 | v130.18,94.61 U$1.33 107.95,94.61 104.14,98.42 97.16,98.42 95.57,96.84 71.44,96.84 69.85,98.42 v59.37,98.42 | IC2.20 35.56,76.83 36.83,75.56 v40.64,75.56 v59.37,75.56 | U$2.5 22.86,30.48 24.13,31.75 v40.64,31.75 v76.52,31.75 | CON1.19 v76.52,29.21
A2  (via drill 0.6 pad 1.42)
  Top 0.406: v128.91,61.91 v128.91,97.16 | v43.18,65.41 v43.18,29.21 | v60.64,100.97 v60.64,65.41
  Bottom 0.406: SV2.17 153.03,75.56 136.84,59.37 129.54,59.37 128.91,60.01 v128.91,61.91 | v128.91,97.16 U$1.34 107.95,97.16 104.14,100.97 97.16,100.97 93.98,97.79 73.66,97.79 72.71,98.74 72.71,100.33 72.07,100.97 v60.64,100.97 | U$2.6 22.86,27.94 24.13,29.21 v43.18,29.21 50.16,29.21 51.44,30.48 77.15,30.48 77.79,29.84 CON1.18 | v60.64,65.41 v43.18,65.41
A3  (via drill 0.6 pad 1.42)
  Top 0.406: v127.64,60.64 v127.64,99.69 | v100.33,103.5 v100.33,53.02 | v45.72,51.75 v45.72,26.67 | v135.89,19.68 v135.89,57.78
  Bottom 0.406: SV2.18 156.84,74.3 153.03,74.3 136.53,57.78 v135.89,57.78 129.22,57.78 127.64,59.37 v127.64,60.64 | v127.64,99.69 U$1.35 107.95,99.69 104.14,103.5 v100.33,103.5 | v45.72,26.67 24.13,26.67 22.86,25.4 U$2.7 | IC4.14 149.22,18.41 147.96,19.68 v135.89,19.68 | v100.33,53.02 46.99,53.02 v45.72,51.75
A4  (via drill 0.6 pad 1.42)
  Top 0.406: v126.36,61.91 v126.36,104.78 | v134.62,20.95 v134.62,56.2
  Bottom 0.406: SV2.19 153.03,73.03 136.21,56.2 v134.62,56.2 129.54,56.2 126.36,59.37 v126.36,61.91 | v126.36,104.78 U$1.37 | IC4.13 152.08,15.88 152.72,16.51 152.72,19.05 152.08,19.68 149.22,19.68 147.96,20.95 IC4.2 v134.62,20.95
A5  (via drill 0.6 pad 1.42)
  Top 0.406: v125.09,60.64 v125.09,107.31
  Bottom 0.406: SV2.20 156.84,71.75 153.03,71.75 135.89,54.61 129.86,54.61 125.09,59.37 v125.09,60.64 | v125.09,107.31 U$1.38
A6  (via drill 0.6 pad 1.42)
  Top 0.406: v123.83,61.91 v123.83,109.86
  Bottom 0.406: SV2.21 153.03,70.48 136.21,53.66 129.54,53.66 123.83,59.37 v123.83,61.91 | v123.83,109.86 U$1.39
A7  (via drill 0.6 pad 1.42)
  Top 0.406: v122.56,60.64 v122.56,112.39
  Bottom 0.406: SV2.22 156.84,69.22 153.03,69.22 136.53,52.7 129.22,52.7 122.56,59.37 v122.56,60.64 | U$1.40 v122.56,112.39
A8  (via drill 0.6 pad 1.42)
  Top 0.406: v145.41,85.72 v145.41,59.69
  Bottom 0.406: U$5.4 133.35,84.45 134.62,85.72 v145.41,85.72 | SV2.23 153.67,67.94 v145.41,59.69
A9  (via drill 0.6 pad 1.42)
  Top 0.406: v144.15,84.45 v144.15,58.1
  Bottom 0.406: U$5.21 v144.15,84.45 | SV2.24 156.84,66.67 154.31,66.67 145.73,58.1 v144.15,58.1
A10  (via drill 0.6 pad 1.42)
  Top 0.406: v142.88,80.64 v142.88,56.83
  Bottom 0.406: U$5.6 133.35,79.38 134.62,80.64 v142.88,80.64 | SV2.25 154.31,65.41 145.73,56.83 v142.88,56.83
A11  (via drill 0.6 pad 1.42)
  Top 0.406: v141.6,79.38 v141.6,55.56
  Bottom 0.406: U$5.19 v141.6,79.38 | SV2.26 156.84,64.14 154.31,64.14 145.73,55.56 v141.6,55.56
A12  (via drill 0.6 pad 1.42)
  Top 0.406: v118.11,74.3 v118.11,60.33
  Bottom 0.406: U$5.8 v118.11,74.3 | SV2.27 154.31,62.87 145.73,54.29 139.7,54.29 137.16,51.75 128.91,51.75 120.33,60.33 v118.11,60.33
A13  (via drill 0.6 pad 1.42)
  Top 0.406: v140.34,74.3 v140.34,53.02
  Bottom 0.406: U$5.17 v140.34,74.3 | SV2.28 156.84,61.59 154.31,61.59 145.73,53.02 v140.34,53.02
A14  (via drill 0.6 pad 1.42)
  Top 0.406: v132.72,69.22 v132.72,50.48
  Bottom 0.406: SV2.29 154.31,60.33 145.73,51.75 138.43,51.75 137.16,50.48 v132.72,50.48 | U$5.10 v132.72,69.22
A15  (via drill 0.6 pad 1.42)
  Top 0.406: v139.06,69.22 v139.06,50.48
  Bottom 0.406: U$5.15 v139.06,69.22 | SV2.30 156.84,59.05 154.31,59.05 145.73,50.48 v139.06,50.48
ADSTB  (via drill 0.6 pad 1.42)
  Top 0.406: v109.22,70.17 v109.22,93.34
  Bottom 0.406: U$5.11 119.38,66.67 118.11,65.41 112.39,65.41 109.22,68.58 v109.22,70.17 | v109.22,93.34 100.97,93.34 99.69,94.61 U$1.8
AEN  (via drill 0.6 pad 1.42)
  Top 0.406: v146.69,73.34 v146.69,38.42 | v107.95,45.4 v107.95,90.81
  Bottom 0.406: U$5.13 137.48,64.14 v146.69,73.34 | SV2.42 156.84,43.81 154.31,43.81 148.91,38.42 v146.69,38.42 127,38.42 120.02,45.4 v107.95,45.4 | U$1.9 99.69,92.08 100.97,90.81 v107.95,90.81
CF_CS0
  Bottom 0.406: CON1.7 91.76,23.81 92.39,24.45 112.08,24.45 113.98,22.54 113.98,15.24 115.89,13.34 IC4.5
CLK  (via drill 0.6 pad 1.42)
  Top 0.406: v40.64,81.92 v40.64,87 | v48.9,59.37 v48.9,56.83 | v46.99,80.64 v46.99,59.37 | v90.17,83.19 v90.17,54.29
  Bottom 0.406: SV2.36 156.84,51.44 154.31,51.44 147.32,44.45 128.59,44.45 120.02,53.02 112.08,53.02 110.81,54.29 v90.17,54.29 75.25,54.29 72.71,56.83 v48.9,56.83 | IC2.9 v40.64,87 38.73,87 36.2,89.53 IC2.15 | v48.9,59.37 v46.99,59.37 35.88,59.37 31.11,64.14 IC6.20 | IC2.18 v40.64,81.92 41.91,80.64 v46.99,80.64 | v90.17,83.19 93.98,83.19 95.25,84.45 U$1.12
CS_0
  Bottom 0.406: SV2.57 154.62,24.77 151.76,27.62 123.83,27.62 117.79,33.66 108.9,33.66 99.69,42.86 86.04,42.86 79.69,49.21 54.29,49.21 51.44,46.35 23.5,46.35 22.54,45.4 22.54,39.69 20.95,38.1 U$2.2
CS_1
  Bottom 0.406: SV2.58 156.84,23.5 153.03,23.5 151.76,22.23 149.22,22.23 147.96,23.5 IC4.1
CS_2
  Bottom 0.406: SV2.59 153.67,22.23 152.4,20.95 IC4.15
CS_DMA  (via drill 0.6 pad 1.42)
  Top 0.406: v115.57,85.72 v115.57,15.88
  Bottom 0.406: U$1.11 99.69,87 100.97,85.72 v115.57,85.72 | IC4.4 v115.57,15.88
CS_INT  (via drill 0.6 pad 1.42)
  Top 0.406: v92.71,59.37 v92.71,38.73 | v118.11,9.53 v118.11,26.99
  Bottom 0.406: IC4.9 145.41,5.71 144.15,6.99 141.29,6.99 138.75,9.53 120.02,9.53 | v92.71,38.73 98.74,38.73 107.63,29.84 116.52,29.84 118.11,28.26 v118.11,26.99
  Bottom 0.61: IC1.1 v92.71,59.37 | 120.02,9.53 v118.11,9.53
CTS  (via drill 0.6 pad 1.42)
  Top 0.406: v30.48,56.52 v30.48,91.12
  Bottom 0.406: IC7.9 28.57,95.89 30.48,93.98 v30.48,91.12
  Bottom 0.61: IC6.17 v30.48,56.52
D0  (via drill 0.6 pad 1.42)
  Top 0.406: v41.91,30.48 v41.91,84.45 | v48.26,30.48 v48.26,27.94
  Bottom 0.406: SV2.7 134.62,88.27 133.35,87 U$5.3 U$1.30 100.97,87 99.69,88.27 94.93,88.27 93.66,87 IC1.11 89.53,87 88.27,85.72 66.04,85.72 64.77,84.45 IC3.12 IC2.8 v41.91,84.45 36.83,84.45 35.56,85.72 26.67,85.72 26.04,85.09 26.04,82.55 26.67,81.92 IC6.27 | U$2.14 v41.91,30.48 v48.26,30.48 | CON1.21 73.98,24.77 69.22,29.53 51.75,29.53 50.16,27.94 v48.26,27.94
D1  (via drill 0.6 pad 1.42)
  Top 0.406: v44.45,81.92 v44.45,27.94
  Bottom 0.406: SV2.8 156.84,87 U$5.22 134.62,87 133.35,85.72 119.38,85.72 118.11,84.45 U$1.29 100.97,84.45 99.69,85.72 94.93,85.72 93.66,84.45 IC1.10 89.53,84.45 88.27,83.19 66.04,83.19 64.77,81.92 IC3.13 IC2.7 v44.45,81.92 42.55,81.92 41.27,83.19 30.48,83.19 29.21,84.45 IC6.28 | U$2.13 v44.45,27.94 46.35,27.94 47.94,26.35 69.85,26.35 72.71,23.5 CON1.22
D2  (via drill 0.6 pad 1.42)
  Top 0.406: v39.37,25.4 v39.37,80.64
  Bottom 0.406: SV2.9 147.32,85.72 144.78,83.19 134.62,83.19 133.35,81.92 U$5.5 U$1.28 100.97,81.92 99.69,83.19 95.25,83.19 93.98,81.92 IC1.9 80.01,81.92 78.74,80.64 66.04,80.64 64.77,79.38 IC3.14 IC2.6 40.64,79.38 v39.37,80.64 25.4,80.64 24.77,81.28 17.78,81.28 14.61,84.45 IC6.1 | U$2.12 v39.37,25.4 69.53,25.4 71.44,23.5 CON1.23
D3  (via drill 0.6 pad 1.42)
  Top 0.406: v36.83,22.86 v36.83,78.11 | v6.35,81.92 v6.35,14.61
  Bottom 0.406: SV2.10 156.84,84.45 147.32,84.45 144.78,81.92 U$5.20 134.62,81.92 133.35,80.64 119.38,80.64 118.11,79.38 U$1.27 100.97,79.38 99.69,80.64 95.25,80.64 93.98,79.38 IC1.8 91.44,79.38 90.17,78.11 61.28,78.11 60.01,76.83 IC3.15 IC2.5 38.1,76.83 v36.83,78.11 19.68,78.11 15.88,81.92 IC6.2 v6.35,81.92 | U$2.11 v36.83,22.86 | CON1.2 98.11,13.65 92.71,8.26 62.87,8.26 60.33,10.79 10.16,10.79 v6.35,14.61
D4  (via drill 0.6 pad 1.42)
  Top 0.406: v7.62,74.3 v7.62,15.88
  Bottom 0.406: SV2.11 147.32,83.19 142.24,78.11 134.62,78.11 133.35,76.83 U$5.7 U$1.26 100.97,76.83 99.69,78.11 95.25,78.11 93.98,76.83 IC1.7 91.44,76.83 90.17,75.56 61.28,75.56 60.01,74.3 IC3.16 IC2.4 36.83,74.3 35.56,75.56 26.35,75.56 24.45,73.66 15.24,73.66 14.61,74.3 IC6.5 v7.62,74.3 | CON1.3 96.84,13.65 92.39,9.21 63.18,9.21 60.33,12.06 11.43,12.06 v7.62,15.88
D5  (via drill 0.6 pad 1.42)
  Top 0.406: v8.89,71.75 v8.89,17.14
  Bottom 0.406: SV2.12 156.84,81.92 147.32,81.92 142.24,76.83 U$5.18 134.62,76.83 133.99,76.2 133.99,73.66 133.35,73.03 119.38,73.03 118.11,71.75 118.11,69.85 117.47,69.22 U$1.23 112.39,69.22 111.76,69.85 111.76,71.12 108.58,74.3 100.97,74.3 99.69,75.56 95.25,75.56 93.98,74.3 IC1.6 91.44,74.3 90.17,73.03 65.41,73.03 64.14,71.75 IC3.17 IC2.3 36.83,71.75 35.56,73.03 26.35,73.03 25.08,71.75 IC6.6 v8.89,71.75 | CON1.4 95.57,13.65 92.08,10.16 63.5,10.16 60.33,13.34 12.7,13.34 v8.89,17.14
D6  (via drill 0.6 pad 1.42)
  Top 0.406: v10.16,69.22 v10.16,18.41
  Bottom 0.406: SV2.13 148.59,80.64 140.97,73.03 134.62,73.03 133.35,71.75 U$5.9 119.38,71.75 118.75,71.12 118.75,67.63 117.79,66.67 U$1.22 112.39,66.67 110.81,68.26 110.81,70.8 109.86,71.75 100.97,71.75 99.69,73.03 95.25,73.03 93.98,71.75 IC1.5 91.44,71.75 90.17,70.48 67.31,70.48 66.04,69.22 IC3.18 IC2.2 36.83,69.22 35.56,70.48 26.67,70.48 25.4,69.22 IC6.7 v10.16,69.22 | CON1.5 94.3,13.65 91.76,11.11 63.82,11.11 60.33,14.61 13.97,14.61 v10.16,18.41
D7  (via drill 0.6 pad 1.42)
  Top 0.406: v14.92,66.67 v14.92,15.88
  Bottom 0.406: SV2.14 156.84,79.38 148.59,79.38 140.97,71.75 U$5.16 134.62,71.75 133.99,71.12 133.99,67.31 132.08,65.41 119.38,65.41 118.11,64.14 U$1.21 112.39,64.14 107.31,69.22 100.97,69.22 99.69,70.48 95.25,70.48 93.98,69.22 IC1.4 91.44,69.22 90.17,67.94 67.31,67.94 66.04,66.67 IC3.19 IC2.1 36.83,66.67 35.56,67.94 26.67,67.94 25.4,66.67 v14.92,66.67 IC6.8 | v14.92,15.88 60.33,15.88 64.14,12.06 91.44,12.06 93.03,13.65 CON1.6
DACK1  (via drill 0.6 pad 1.42)
  Top 0.406: v116.84,71.75 v116.84,44.13
  Bottom 0.406: U$1.24 v116.84,71.75 | v116.84,44.13 120.02,44.13 127,37.15 148.91,37.15 154.31,42.55 SV2.43
DACK2  (via drill 0.6 pad 1.42)
  Top 0.406: v110.49,78.11 v110.49,42.86
  Bottom 0.406: SV2.44 156.84,41.27 154.31,41.27 149.22,36.2 126.68,36.2 120.02,42.86 v110.49,42.86 | U$1.14 99.69,79.38 100.97,78.11 v110.49,78.11
DACK3  (via drill 0.6 pad 1.42)
  Top 0.406: v111.76,75.56 v111.76,41.59
  Bottom 0.406: U$1.15 99.69,76.83 100.97,75.56 v111.76,75.56 | v111.76,41.59 120.02,41.59 126.36,35.24 149.54,35.24 154.31,40.01 SV2.45
DRQ1  (via drill 0.6 pad 1.42)
  Top 0.406: v88.9,66.67 v88.9,50.48
  Bottom 0.406: SV2.47 154.31,37.47 150.18,33.34 125.73,33.34 119.7,39.37 110.81,39.37 99.69,50.48 v88.9,50.48 | U$1.18 95.25,69.22 93.98,67.94 91.44,67.94 90.17,66.67 v88.9,66.67
DRQ2  (via drill 0.6 pad 1.42)
  Top 0.406: v87.63,69.22 v87.63,49.21
  Bottom 0.406: U$1.17 95.25,71.75 93.98,70.48 91.44,70.48 90.17,69.22 v87.63,69.22 | SV2.48 156.84,36.2 154.31,36.2 150.5,32.38 125.41,32.38 119.38,38.42 110.49,38.42 99.69,49.21 v87.63,49.21
DRQ3  (via drill 0.6 pad 1.42)
  Top 0.406: v86.36,71.75 v86.36,50.48
  Bottom 0.406: U$1.16 95.25,74.3 93.98,73.03 91.44,73.03 90.17,71.75 v86.36,71.75 | SV2.49 154.31,34.92 150.81,31.43 125.09,31.43 119.06,37.47 110.17,37.47 99.69,47.94 87,47.94 86.36,48.58 v86.36,50.48
GATE0  (via drill 0.6 pad 1.42)
  Top 0.406: v66.04,71.75 v66.04,92.08
  Bottom 0.406: IC3.24 v66.04,71.75 | IC2.11 50.8,92.08 52.07,90.81 63.5,90.81 64.77,92.08 v66.04,92.08
GATE1  (via drill 0.6 pad 1.42)
  Top 0.406: v64.77,67.94 v64.77,88.27
  Bottom 0.406: v64.77,88.27 40.01,88.27 36.2,92.08 IC2.14 | v64.77,67.94 66.04,67.94 67.31,69.22 IC3.23
GATE2
  Bottom 0.61: R11.1 IC2.16
GND  (via drill 0.6 pad 1.42)
  Top 0.61: v52.7,61.59 v52.7,51.44 | v89.85,99.69 v89.85,94.61 | v144.78,93.98 v144.78,101.6 | v95.57,102.49 v95.57,65.41 | v8.57,103.5 v13.34,103.5 | v43.81,112.71 v43.81,116.84 | v95.57,117.16 v95.57,106.68 | v55.24,38.73 v55.24,23.5 | v146.69,15.24 v146.69,3.17 | v5.08,88.67 v20.07,88.67
  Bottom 0.406: CON1.50 68.26,17.46 79.06,17.46 | 79.06,17.46 80.33,17.46 | 80.33,17.46 81.6,17.46 | 82.87,17.46 85.41,17.46 | 85.41,17.46 86.68,17.46 | 86.68,17.46 87.95,17.46 | 87.95,17.46 89.22,17.46 | 89.22,17.46 90.49,17.46 CON1.8 | CON1.9 89.22,17.46 | CON1.10 87.95,17.46 | CON1.11 86.68,17.46 | CON1.12 85.41,17.46 | CON1.14 82.87,17.46 | CON1.39 82.23,17.46 | 82.23,17.46 82.87,17.46 | 81.6,17.46 CON1.15 81.6,26.04 81.28,26.04 | 81.6,17.46 82.23,17.46 | CON1.16 80.33,17.46 | CON1.17 79.06,17.46 | CON1.1 99.38,17.46 | IC6.22 26.67,69.22 25.4,67.94 11.11,67.94 10.48,67.31
  pour Bottom (isolate 0.61, no thermals): 0,122.56 0,0 167.64,0 167.64,122.56
HLDA  (via drill 0.6 pad 1.42)
  Top 0.406: v102.87,50.48 v102.87,95.89
  Bottom 0.406: SV2.38 156.84,48.9 154.31,48.9 147.96,42.55 127.95,42.55 120.02,50.48 v102.87,50.48 | v102.87,95.89 100.97,95.89 99.69,97.16 U$1.7
HRQ  (via drill 0.6 pad 1.42)
  Top 0.406: v106.68,46.67 v106.68,88.27
  Bottom 0.406: SV2.41 154.31,45.09 148.91,39.69 127,39.69 120.02,46.67 v106.68,46.67 | v106.68,88.27 100.97,88.27 99.69,89.53 U$1.10
INT  (via drill 0.6 pad 1.42)
  Top 0.406: v74.93,56.83 v74.93,89.53
  Bottom 0.406: SV2.32 156.84,56.52 154.31,56.52 146.05,48.26 129.86,48.26 120.33,57.78 94.3,57.78 93.34,56.83 v74.93,56.83 | v74.93,89.53 IC1.17
INTA  (via drill 0.6 pad 1.42)
  Top 0.406: v80.01,55.56 v80.01,66.67
  Bottom 0.406: SV2.33 154.31,55.24 146.37,47.31 129.54,47.31 120.02,56.83 94.61,56.83 93.34,55.56 v80.01,55.56 | v80.01,66.67 IC1.26
IO_RD  (via drill 0.6 pad 1.42)
  Top 0.406: v113.03,55.56 v113.03,62.23 | v62.23,64.14 v62.23,70.48 | v45.72,70.48 v45.72,56.83 | v21.59,22.86 v21.59,53.98 | v109.54,100.97 v109.54,109.86 | v49.53,24.13 v49.53,34.29
  Bottom 0.406: v113.03,55.56 120.02,55.56 129.22,46.35 146.69,46.35 154.31,53.98 156.21,53.98 157.48,55.24 SV2.34 159.7,56.83 159.7,96.52 158.75,97.47 132.08,97.47 128.59,100.97 v109.54,100.97 | IC2.22 35.56,71.75 36.83,70.48 v45.72,70.48 v62.23,70.48 | IC6.13 v21.59,53.98 25.4,53.98 26.67,55.24 44.13,55.24 v45.72,56.83 | v109.54,109.86 U$1.2 | v113.03,62.23 107.31,67.94 95.25,67.94 93.98,66.67 IC1.3 91.44,66.67 90.17,65.41 63.5,65.41 v62.23,64.14 | U$2.8 v21.59,22.86 22.86,24.13 v49.53,24.13 | CON1.34 88.58,28.57 86.68,30.48 82.87,30.48 77.79,35.56 50.8,35.56 v49.53,34.29
IO_WR  (via drill 0.6 pad 1.42)
  Top 0.406: v95.25,55.56 v95.25,60.33 | v59.37,64.14 v59.37,67.94 | v31.75,69.22 v31.75,60.33 | v22.86,20.32 v22.86,60.33 | v108.27,103.5 v108.27,112.39 | v51.44,20.32 v51.44,34.29
  Bottom 0.406: IC6.10 21.59,61.59 v22.86,60.33 v31.75,60.33 | v59.37,67.94 36.83,67.94 35.56,69.22 IC2.23 v31.75,69.22 | v22.86,20.32 U$2.10 v51.44,20.32 | v95.25,55.56 111.12,55.56 112.39,54.29 120.02,54.29 128.91,45.4 147,45.4 154.31,52.7 SV2.35 156.21,52.7 157.48,53.98 159.07,53.98 160.66,55.56 160.66,96.84 159.07,98.42 134.94,98.42 129.86,103.5 v108.27,103.5 | v59.37,64.14 60.64,62.87 78.74,62.87 80.01,64.14 IC1.2 93.98,64.14 95.25,62.87 v95.25,60.33 | v108.27,112.39 U$1.1 | CON1.35 87.31,28.57 86.36,29.53 82.55,29.53 77.79,34.29 v51.44,34.29
IRQ5  (via drill 0.6 pad 1.42)
  Top 0.406: v85.09,49.21 v85.09,74.3
  Bottom 0.406: v85.09,74.3 IC1.23 | SV2.50 156.84,33.66 154.31,33.66 151.13,30.48 124.78,30.48 118.75,36.51 109.86,36.51 99.69,46.67 86.68,46.67 85.09,48.26 v85.09,49.21
IRQ6  (via drill 0.6 pad 1.42)
  Top 0.406: v83.82,50.48 v83.82,71.75
  Bottom 0.406: v83.82,71.75 IC1.24 | SV2.51 154.31,32.38 151.45,29.53 124.46,29.53 118.43,35.56 109.54,35.56 99.69,45.4 86.36,45.4 83.82,47.94 v83.82,50.48
IRQ7  (via drill 0.6 pad 1.42)
  Top 0.406: v82.55,69.22 v82.55,49.21
  Bottom 0.406: IC1.25 v82.55,69.22 | SV2.52 156.84,31.11 154.31,31.11 151.76,28.57 124.14,28.57 118.11,34.61 109.22,34.61 99.69,44.13 86.04,44.13 82.55,47.62 v82.55,49.21
KBD_CS  (via drill 0.6 pad 1.42)
  Top 0.406: v56.83,99.69 v56.83,45.72 | v119.38,10.79 v119.38,25.72
  Bottom 0.406: v56.83,45.72 79.38,45.72 85.09,40.01 98.74,40.01 107.95,30.8 116.84,30.8 119.38,28.26 v119.38,25.72 | IC4.10 145.41,8.26 144.15,9.53 140.97,9.53 139.7,10.79 v119.38,10.79
  Bottom 0.61: IC3.6 v56.83,99.69
KBD_IRQ  (via drill 0.6 pad 1.42)
  Top 0.406: v71.12,88.27 v71.12,99.69
  Bottom 0.406: IC1.18 72.39,87 v71.12,88.27 | v71.12,99.69 IC3.35
KCLK  (via drill 0.6 pad 1.42)
  Top 0.406: v60.64,103.5 v60.64,112.39
  Bottom 0.406: v60.64,103.5 70.17,103.5 73.03,106.36 81.92,106.36 82.87,107.31 IC5.4 86.36,107.31 87.63,108.58 R7.1 133.01,108.58 C8.1 | C8.1 133.32,108.56 133.35,108.58 132.72,108.58 132.74,108.56 C8.1 | v60.64,112.39 IC3.1
  Bottom 0.61: 133.35,108.58 136.01,108.58 J1.1
KDAT
  Bottom 0.406: IC3.39 82.55,109.86 83.82,111.12 86.36,111.12 87.63,109.86 IC5.12 95.89,109.86 97.16,111.12 133.35,111.12 | 133.35,111.12 135.25,111.12 136.21,112.08 142.76,112.08 J1.2 | R8.1 133.34,111.12 133.35,111.12
  Bottom 0.61: J1.2 C7.1
N$1
  Bottom 0.406: U$5.14 138.43,66.67 R1.2 | R1.2
N$2
  Bottom 0.61: IC1.16 R2.2
N$3
  Bottom 0.406: IC3.38 67.31,107.31 66.67,107.95 66.67,110.49 67.31,111.12 80.01,111.12 83.82,114.94 IC5.1
N$4
  Bottom 0.406: CON1.36 R3.1
N$5
  Bottom 0.406: U$1.6 104.14,99.69 107.95,95.89 R12.1
N$6
  Bottom 0.61: IC2.13 R13.1
N$7  (via drill 0.6 pad 1.42)
  Top 0.406: v26.04,97.16 v30.16,97.16
  Bottom 0.406: IC7.7 v26.04,97.16 | v30.16,97.16 30.16,101.92 28.04,104.04 X1.7
N$8  (via drill 0.6 pad 1.42)
  Top 0.406: v29.41,104.57 v23.5,104.57
  Bottom 0.406: X1.2 v29.41,104.57 | IC7.13 18.41,102.23 19.37,103.19 22.11,103.19 v23.5,104.57
N$9
  Bottom 0.406: IC7.1 C4.2
N$10
  Bottom 0.406: C5.2 IC7.4
N$11
  Bottom 0.406: IC7.5 20.95,92.39 20.12,91.55 C5.1
N$12
  Bottom 0.406: IC7.3 15.88,94.61 15.24,95.25 12.7,95.25 12.06,94.61 12.06,92.08 12.5,91.64 C4.1
N$13
  Bottom 0.406: IC7.2 13.34,92.39 14.07,91.66 C6.1
N$14
  Bottom 0.61: C25.1 IC7.6
N$15
  Bottom 0.61: IC3.2 50.04,109.86 Q2.2 C9.2
N$16
  Bottom 0.61: IC3.3 50.04,107.31 Q2.1 C11.2
N$17
  Bottom 0.406: IC5.3 84.14,109.86 81.6,107.31 72.71,107.31 70.17,104.78 IC3.37
N$18  (via drill 0.6 pad 1.42)
  Top 0.406: v26.67,106.68 v23.5,106.68
  Bottom 0.406: X1.3 v26.67,106.68 | IC7.14 15.88,101.92 18.41,104.46 21.27,104.46 v23.5,106.68
N$19
  Bottom 0.406: CON1.44 75.88,26.99 74.61,28.26 R4.1
N$20
  Bottom 0.406: R9.2 90.17,112.4 90.17,112.39
  Bottom 0.61: IC5.2 90.17,112.39 IC5.13
N$21
  Bottom 0.406: CON1.46 73.34,24.13 69.53,27.94 R5.1
N$22
  Bottom 0.61: BATTERY_1.+ 119.38,23.5 114.3,28.57 107.31,28.57 98.74,37.15 86.36,37.15 80.33,43.18 D1.A
N$23  (via drill 0.6 pad 1.27)
  other vias: 5,117.39
N$24  (via drill 0.6 pad 1.27)
  other vias: 162.48,5
N$25  (via drill 0.6 pad 1.27)
  other vias: 162.48,117.39
N$26
  Bottom 0.61: R13.2 T1.1
N$27
  Bottom 0.61: 42.37,98.74 42.37,98.42 | 42.37,98.42 T1.3 | R15.1 42.38,98.44 42.37,98.42
N$28
  Bottom 0.406: IC7.8 28.57,94.61 27.3,95.89 27.3,102.55 25.3,104.56 X1.8
N$29
  Bottom 0.406: CON1.32 R6.1
N$30
  Bottom 0.61: JP1.1 C22.-
N$31
  Bottom 0.61: R14.1 R15.2 C22.+
N$32  (via drill 0.6 pad 1.42)
  Top 0.406: v87.31,79.38 v87.31,102.23
  Bottom 0.406: IC1.21 v87.31,79.38 | R17.1 79.06,105.09 81.92,102.23 IC5.6
  Bottom 0.61: v87.31,102.23 IC5.6
N$35
  Bottom 0.406: R19.1 IC3.5
N$37  (via drill 0.6 pad 1.27)
  other vias: 5,5
RD  (via drill 0.6 pad 1.42)
  Top 0.406: v104.14,49.21 v104.14,94.61 | v106.05,107.31 v106.05,94.61
  Bottom 0.406: SV2.39 154.31,47.62 148.27,41.59 127.64,41.59 120.02,49.21 v104.14,49.21 | IC3.8 64.77,94.61 66.04,95.89 99.69,95.89 100.97,94.61 v104.14,94.61 v106.05,94.61 | U$1.3 v106.05,107.31
RESET  (via drill 0.6 pad 1.42)
  Top 0.406: v101.6,80.64 v101.6,59.05
  Bottom 0.406: SV2.31 154.31,57.78 145.73,49.21 130.18,49.21 120.33,59.05 v101.6,59.05 94.3,59.05 93.34,58.1 35.88,58.1 31.11,62.87 26.67,62.87 26.04,63.5 26.04,66.04 26.67,66.67 IC6.21 | U$1.13 99.69,81.92 100.97,80.64 v101.6,80.64
RTC_IRQ  (via drill 0.6 pad 1.42)
  Top 0.406: v81.28,50.48 v81.28,104.78
  Bottom 0.406: v81.28,50.48 54.29,50.48 51.44,47.62 23.5,47.62 21.59,45.72 21.59,41.27 20.95,40.64 U$2.1 15.56,40.64 14.92,40.01 R10.2 | IC5.5 v81.28,104.78
RTS  (via drill 0.6 pad 1.42)
  Top 0.406: v17.46,83.5 v17.46,70.48
  Bottom 0.406: IC7.10 26.04,99.38 22.86,96.2 9.84,96.2 8.57,94.93 8.57,89.53 9.84,88.27 15.88,88.27 17.46,86.68 v17.46,83.5 | v17.46,70.48 25.08,70.48 26.35,71.75 IC6.23
RXD_TTL  (via drill 0.6 pad 1.42)
  Top 0.406: v14.92,86.04 v14.92,79.38
  Bottom 0.406: IC7.12 20.95,98.74 20.32,98.11 9.21,98.11 6.67,95.57 6.67,88.9 9.53,86.04 v14.92,86.04 | v14.92,79.38 IC6.3
SOSCI
  Bottom 0.61: U$2.17 28.57,38.1 | 28.57,38.1 C20.2 | X2.1 28.57,38.1
SOSCO
  Bottom 0.61: U$2.16 28.57,35.56 | 28.57,35.56 C23.2 | X2.2 28.57,35.56
TC_8257  (via drill 0.6 pad 1.42)
  Top 0.406: v131.76,99.69 v135.57,99.69
  Bottom 0.406: U$1.36 129.22,102.23 v131.76,99.69 | v135.57,99.69 159.07,99.69 161.61,97.16 161.61,55.24 159.7,53.34 159.7,31.43 SV2.54
TIMER_CS  (via drill 0.6 pad 1.42)
  Top 0.406: v55.56,73.03 v55.56,46.99 | v120.65,12.06 v120.65,26.99
  Bottom 0.406: IC2.21 35.56,74.3 36.83,73.03 v55.56,73.03 | v55.56,46.99 79.38,46.99 85.41,40.96 99.06,40.96 108.27,31.75 117.16,31.75 120.65,28.26 v120.65,26.99 | IC4.11 145.41,10.79 144.15,12.06 v120.65,12.06
TIMER_IRQ  (via drill 0.6 pad 1.42)
  Top 0.406: v46.99,99.06 v46.99,89.53 | v79.69,108.58 v79.69,76.83
  Bottom 0.406: v46.99,99.06 50.8,99.06 51.44,99.69 51.44,102.87 52.07,103.5 58.74,103.5 61.28,106.05 70.17,106.05 72.71,108.58 v79.69,108.58 | v46.99,89.53 IC2.10
  Bottom 0.61: v79.69,76.83 IC1.22
TXD  (via drill 0.6 pad 1.42)
  Top 0.406: v16.19,84.77 v16.19,65.41
  Bottom 0.406: IC7.11 23.5,98.42 22.23,97.16 9.53,97.16 7.62,95.25 7.62,89.22 9.53,87.31 15.56,87.31 16.19,86.68 v16.19,84.77 | IC6.19 26.04,61.59 22.23,65.41 v16.19,65.41
UART_BAUD  (via drill 0.6 pad 1.42)
  Top 0.406: v31.75,76.83 v31.75,84.45 | v20,74.93 v20,64.14
  Bottom 0.406: v20,74.93 24.45,74.93 26.35,76.83 IC6.25 v31.75,76.83 | v31.75,84.45 IC2.17 | v20,64.14 IC6.9
UART_CS  (via drill 0.6 pad 1.42)
  Top 0.406: v24.13,59.05 v24.13,45.09 | v121.92,14.61 v121.92,25.72
  Bottom 0.406: IC6.11 v24.13,59.05 | IC4.12 145.41,13.34 144.15,14.61 v121.92,14.61 | v121.92,25.72 121.92,28.26 117.47,32.7 108.58,32.7 99.38,41.91 85.72,41.91 79.38,48.26 54.61,48.26 51.44,45.09 v24.13,45.09
UART_RX_IRQ  (via drill 0.6 pad 1.42)
  Top 0.406: v71.12,81.92 v71.12,55.56
  Bottom 0.406: IC6.14 25.4,51.44 26.67,52.7 43.18,52.7 46.04,55.56 v71.12,55.56 | IC1.20 v71.12,81.92
UART_TX_IRQ  (via drill 0.6 pad 1.42)
  Top 0.406: v72.39,54.29 v72.39,84.45
  Bottom 0.406: v72.39,84.45 IC1.19 | IC6.15 43.18,51.44 46.04,54.29 v72.39,54.29
VCC  (via drill 0.6 pad 1.42)  (2 unrouted)
  Top 0.406: v149.86,78.11 v149.86,92.08 | v52.7,27.94 v52.7,36.83 | v38.1,35.56 v38.1,33.02 | v88.58,92.08 v88.58,114.94
  Top 0.61: v111.12,89.53 v111.12,114.94 | v63.5,76.83 v63.5,114.94 | v63.5,74.3 v63.5,59.69 | v149.86,104.78 v149.86,95.89 | v25.4,87 v25.4,79.38 | v65.41,36.83 v65.41,59.69 | v61.91,76.83 v61.91,74.3 | v86.04,27.94 v86.04,32.07
  Bottom 0.406: v149.86,78.11 | v149.86,78.11 R1.1 | R8.2 133.03,113.35 | 14.92,35.56 U$2.3 | R5.2 v52.7,27.94 | R3.2 84.14,26.25 | 84.14,26.25 CON1.13 | 84.14,26.25 83.5,26.25 | 83.5,26.25 CON1.38 | R10.1 14.92,35.56 | 14.92,35.56 14.92,32.7 15.88,31.75 22.86,31.75 24.13,33.02 U$2.15 v38.1,33.02 | C3.1 34.61,64.45 34.29,64.14 | 83.5,26.25 C19.1 | C19.1 | R12.2 v149.86,95.89 | C16.1 140.02,25.72 | R9.1 90.49,114.62 90.81,114.94
  Bottom 0.61: v111.12,89.53 U$1.31 C1.1 | U$5.24 138.11,92.08 | 138.11,92.08 v149.86,92.08 v149.86,95.89 | v149.86,104.78 149.86,107.47 J1.5 | IC3.26 v63.5,76.83 v61.91,76.83 | R19.2 65.09,114.94 | C2.1 22.99,79.38 v25.4,79.38 IC6.26 | C10.1 IC7.16 | C12.1 68.58,114.94 | C14.1 IC5.14 | C15.1 138.11,92.08 | C17.1 | R2.1 v88.58,92.08 | 34.52,114.94 34.52,109.14 32.07,106.68 R14.2 32.07,90.49 30.27,88.69 R11.2 v25.4,87 19.33,87 C6.2 | C24.+ 70.8,37.15 71.12,36.83 | v61.91,74.3 v63.5,74.3 IC3.25 | IC4.16 149.54,23.5 147.42,25.61 C16.1 | 140.02,25.72 132.72,25.72 128.27,21.27 119.38,21.27 114.62,26.04 94.61,26.04 93.13,27.52 R6.2 | v86.04,27.94 R3.2 | v38.1,35.56 48.58,35.56 49.85,36.83 v52.7,36.83
  Bottom 0.813: IC2.24 34.29,64.14 34.29,62.87 36.2,60.96 49.85,60.96 51.12,59.69 v63.5,59.69 v65.41,59.69 C17.1 74.3,59.69 76.2,61.59 | IC3.40 68.58,114.94 | v52.7,36.83 v65.41,36.83 71.12,36.83 R4.2 78.42,36.83 83.19,32.07 v86.04,32.07 88.58,32.07 91.12,29.53 R6.2 | R17.2 75.56,114.94
  Bottom 1.016: 132.72,113.67 R7.2 127.64,114.94 v111.12,114.94 IC5.14 90.81,114.94 v88.58,114.94 86.68,116.84 83.19,116.84 81.28,114.94 C21.+ 75.56,114.94 68.58,114.94 65.09,114.94 v63.5,114.94 34.52,114.94 20.32,114.94 18.41,113.03 18.41,109.54 15.88,107 10.79,107 | 132.72,113.67 146.69,113.67 149.78,110.57 J1.5 | 133.03,113.35 132.72,113.67 | 10.79,107 IC7.16 | 10.79,107 JP3.1
VPA
  Bottom 0.406: C13.2 | C18.+
  Bottom 0.61: D1.C D2.C C18.+ C13.2 26.04,43.18 25.4,42.55 U$2.18
WR  (via drill 0.6 pad 1.42)
  Top 0.406: v105.41,47.94 v105.41,89.53 | v101.6,104.78 v101.6,89.53
  Bottom 0.406: SV2.40 156.84,46.35 154.31,46.35 148.59,40.64 127.32,40.64 120.02,47.94 v105.41,47.94 | v101.6,104.78 U$1.4 | IC3.10 63.5,89.53 64.77,90.81 99.69,90.81 100.97,89.53 v101.6,89.53 v105.41,89.53